# EasyEDA Pro project TeensySensor20250629.eprj

# Schematic Sigyn Sensor Board

## Sheets
1 Teensy: Board Name: Board1; Create Date: 2025-06-20; Page Name: Teensy; Project Name: TeensySensor; Schematic Name: Sigyn Sensor Board; Update Date: 2025-06-19; Company: Wimble Robotics; Drawed: Michael Wimble; Page Size: A4; Part Number: JLCPCB-002; Reviewed: Michael Wimble; Version: V1.0
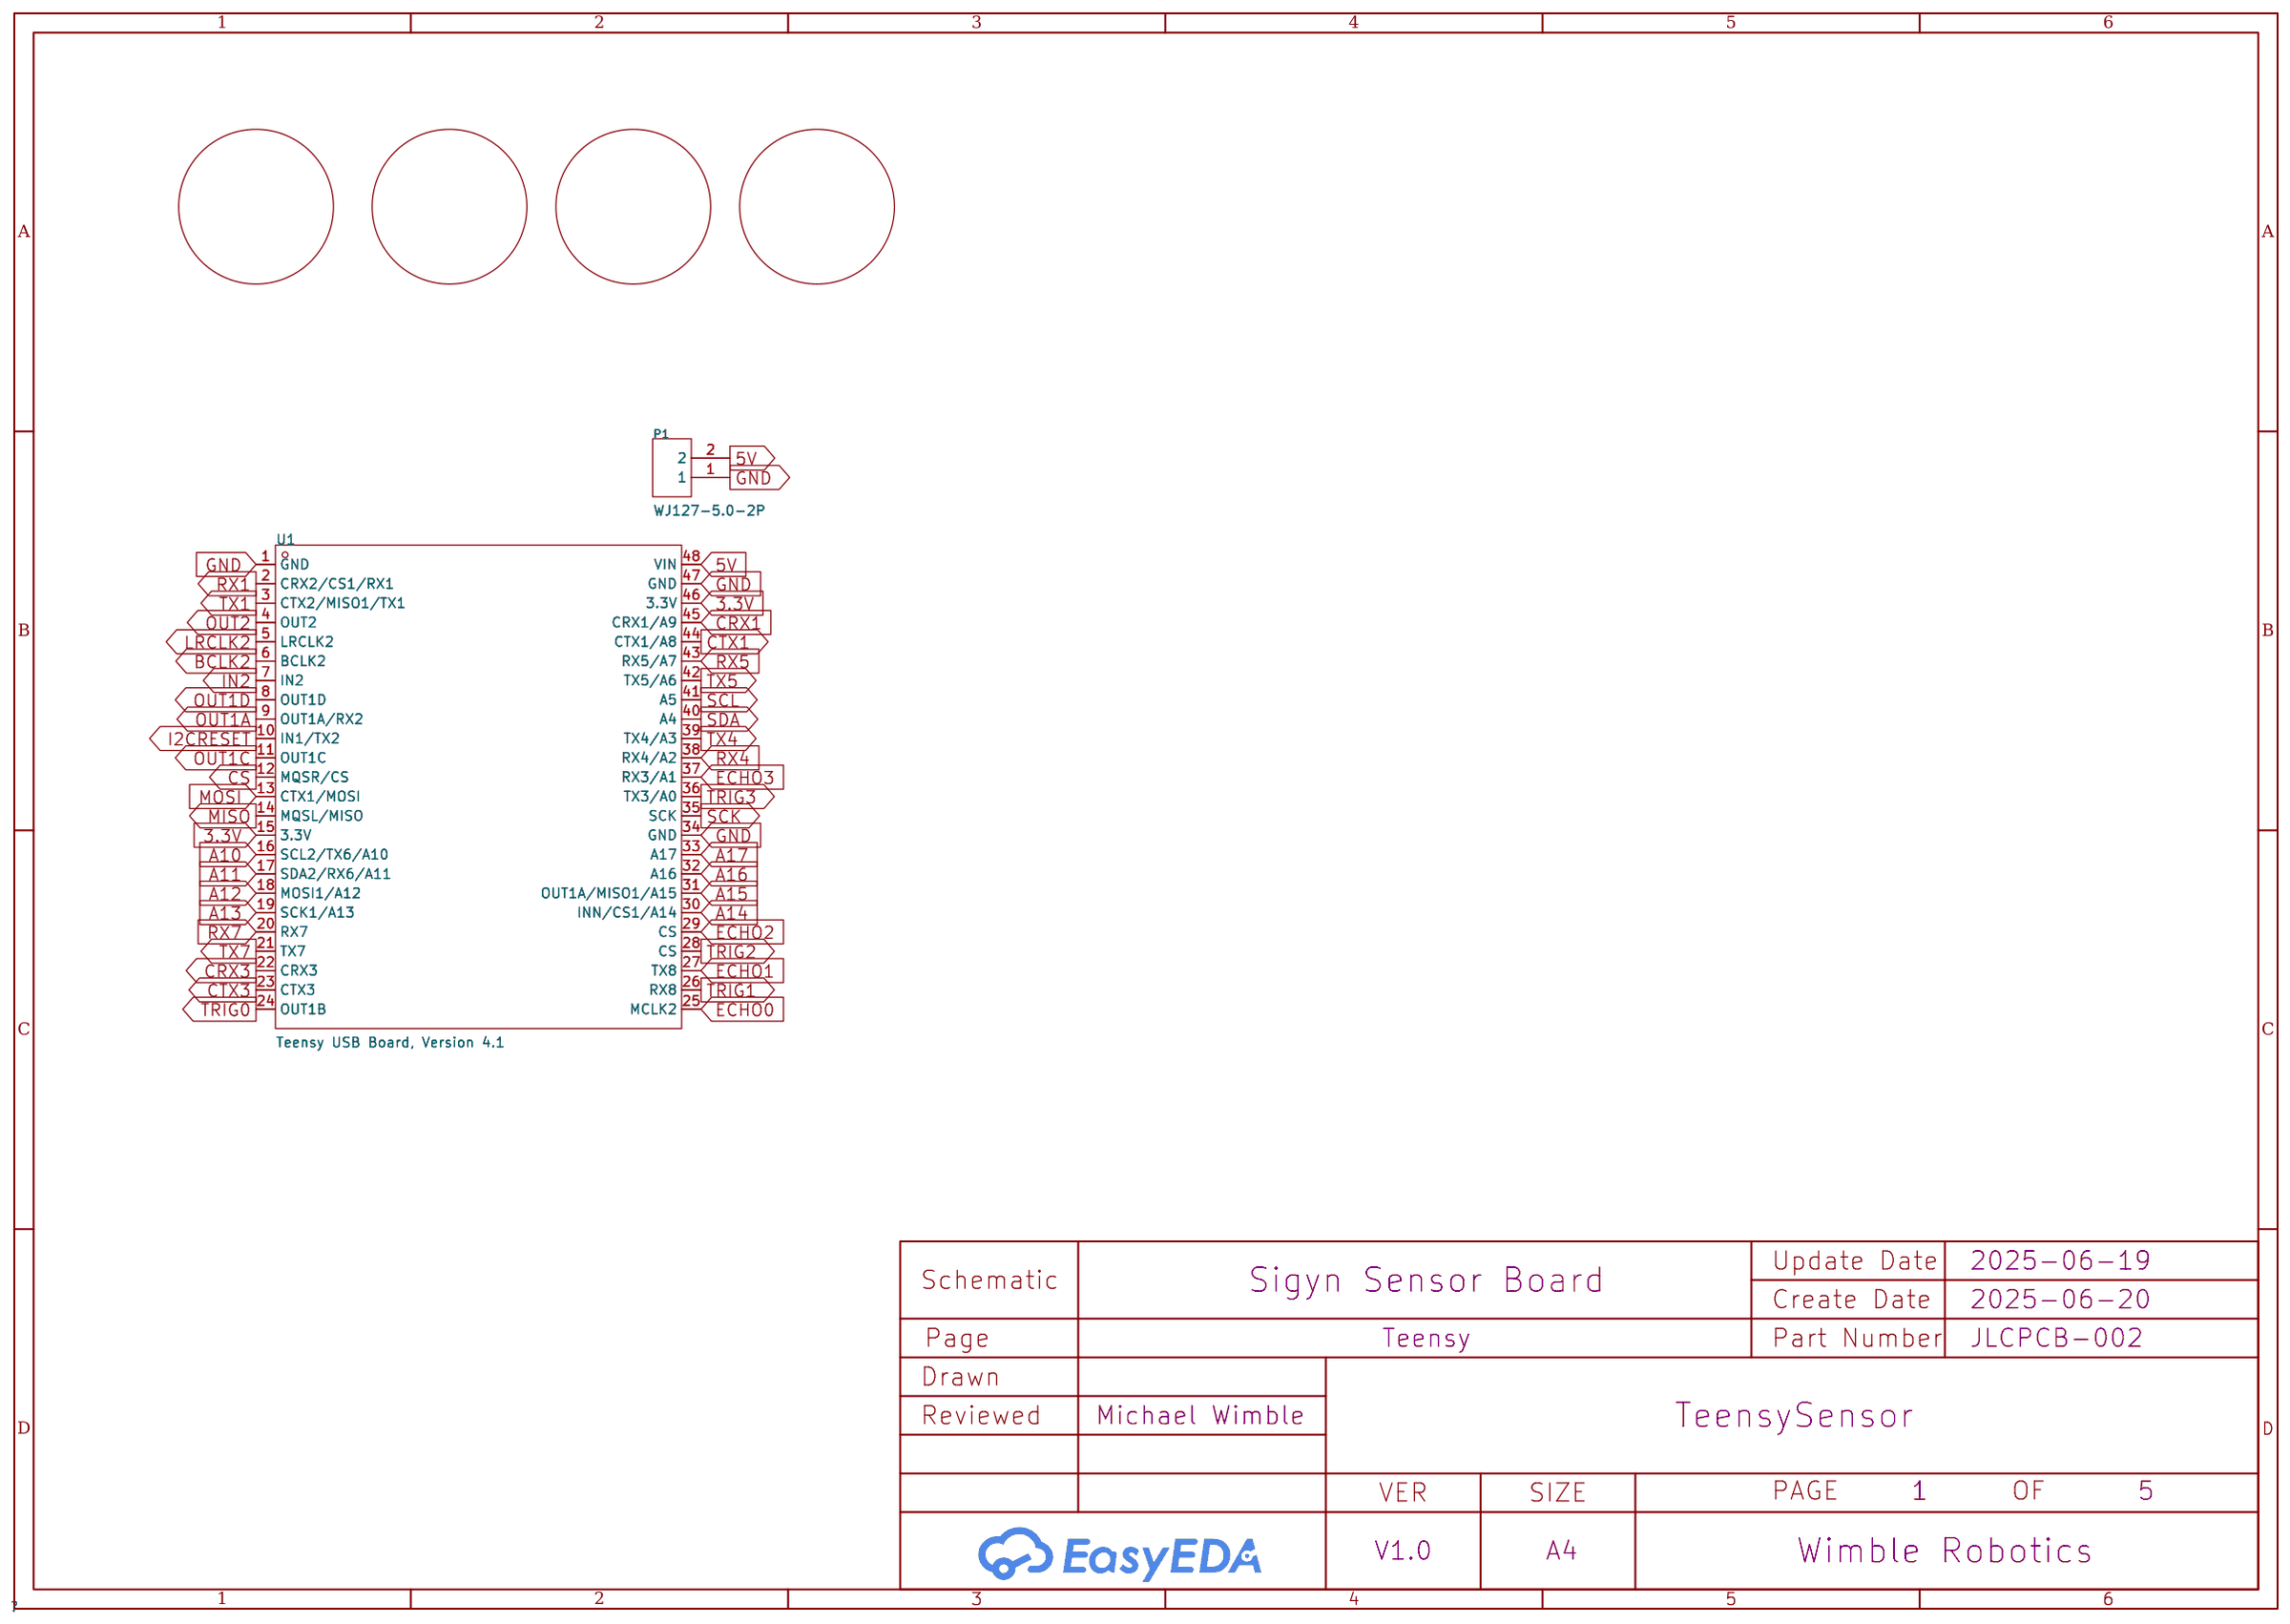
[diagram p0: Teensy]
2 Time of Flight Sensors: Page Name: Time of Flight Sensors
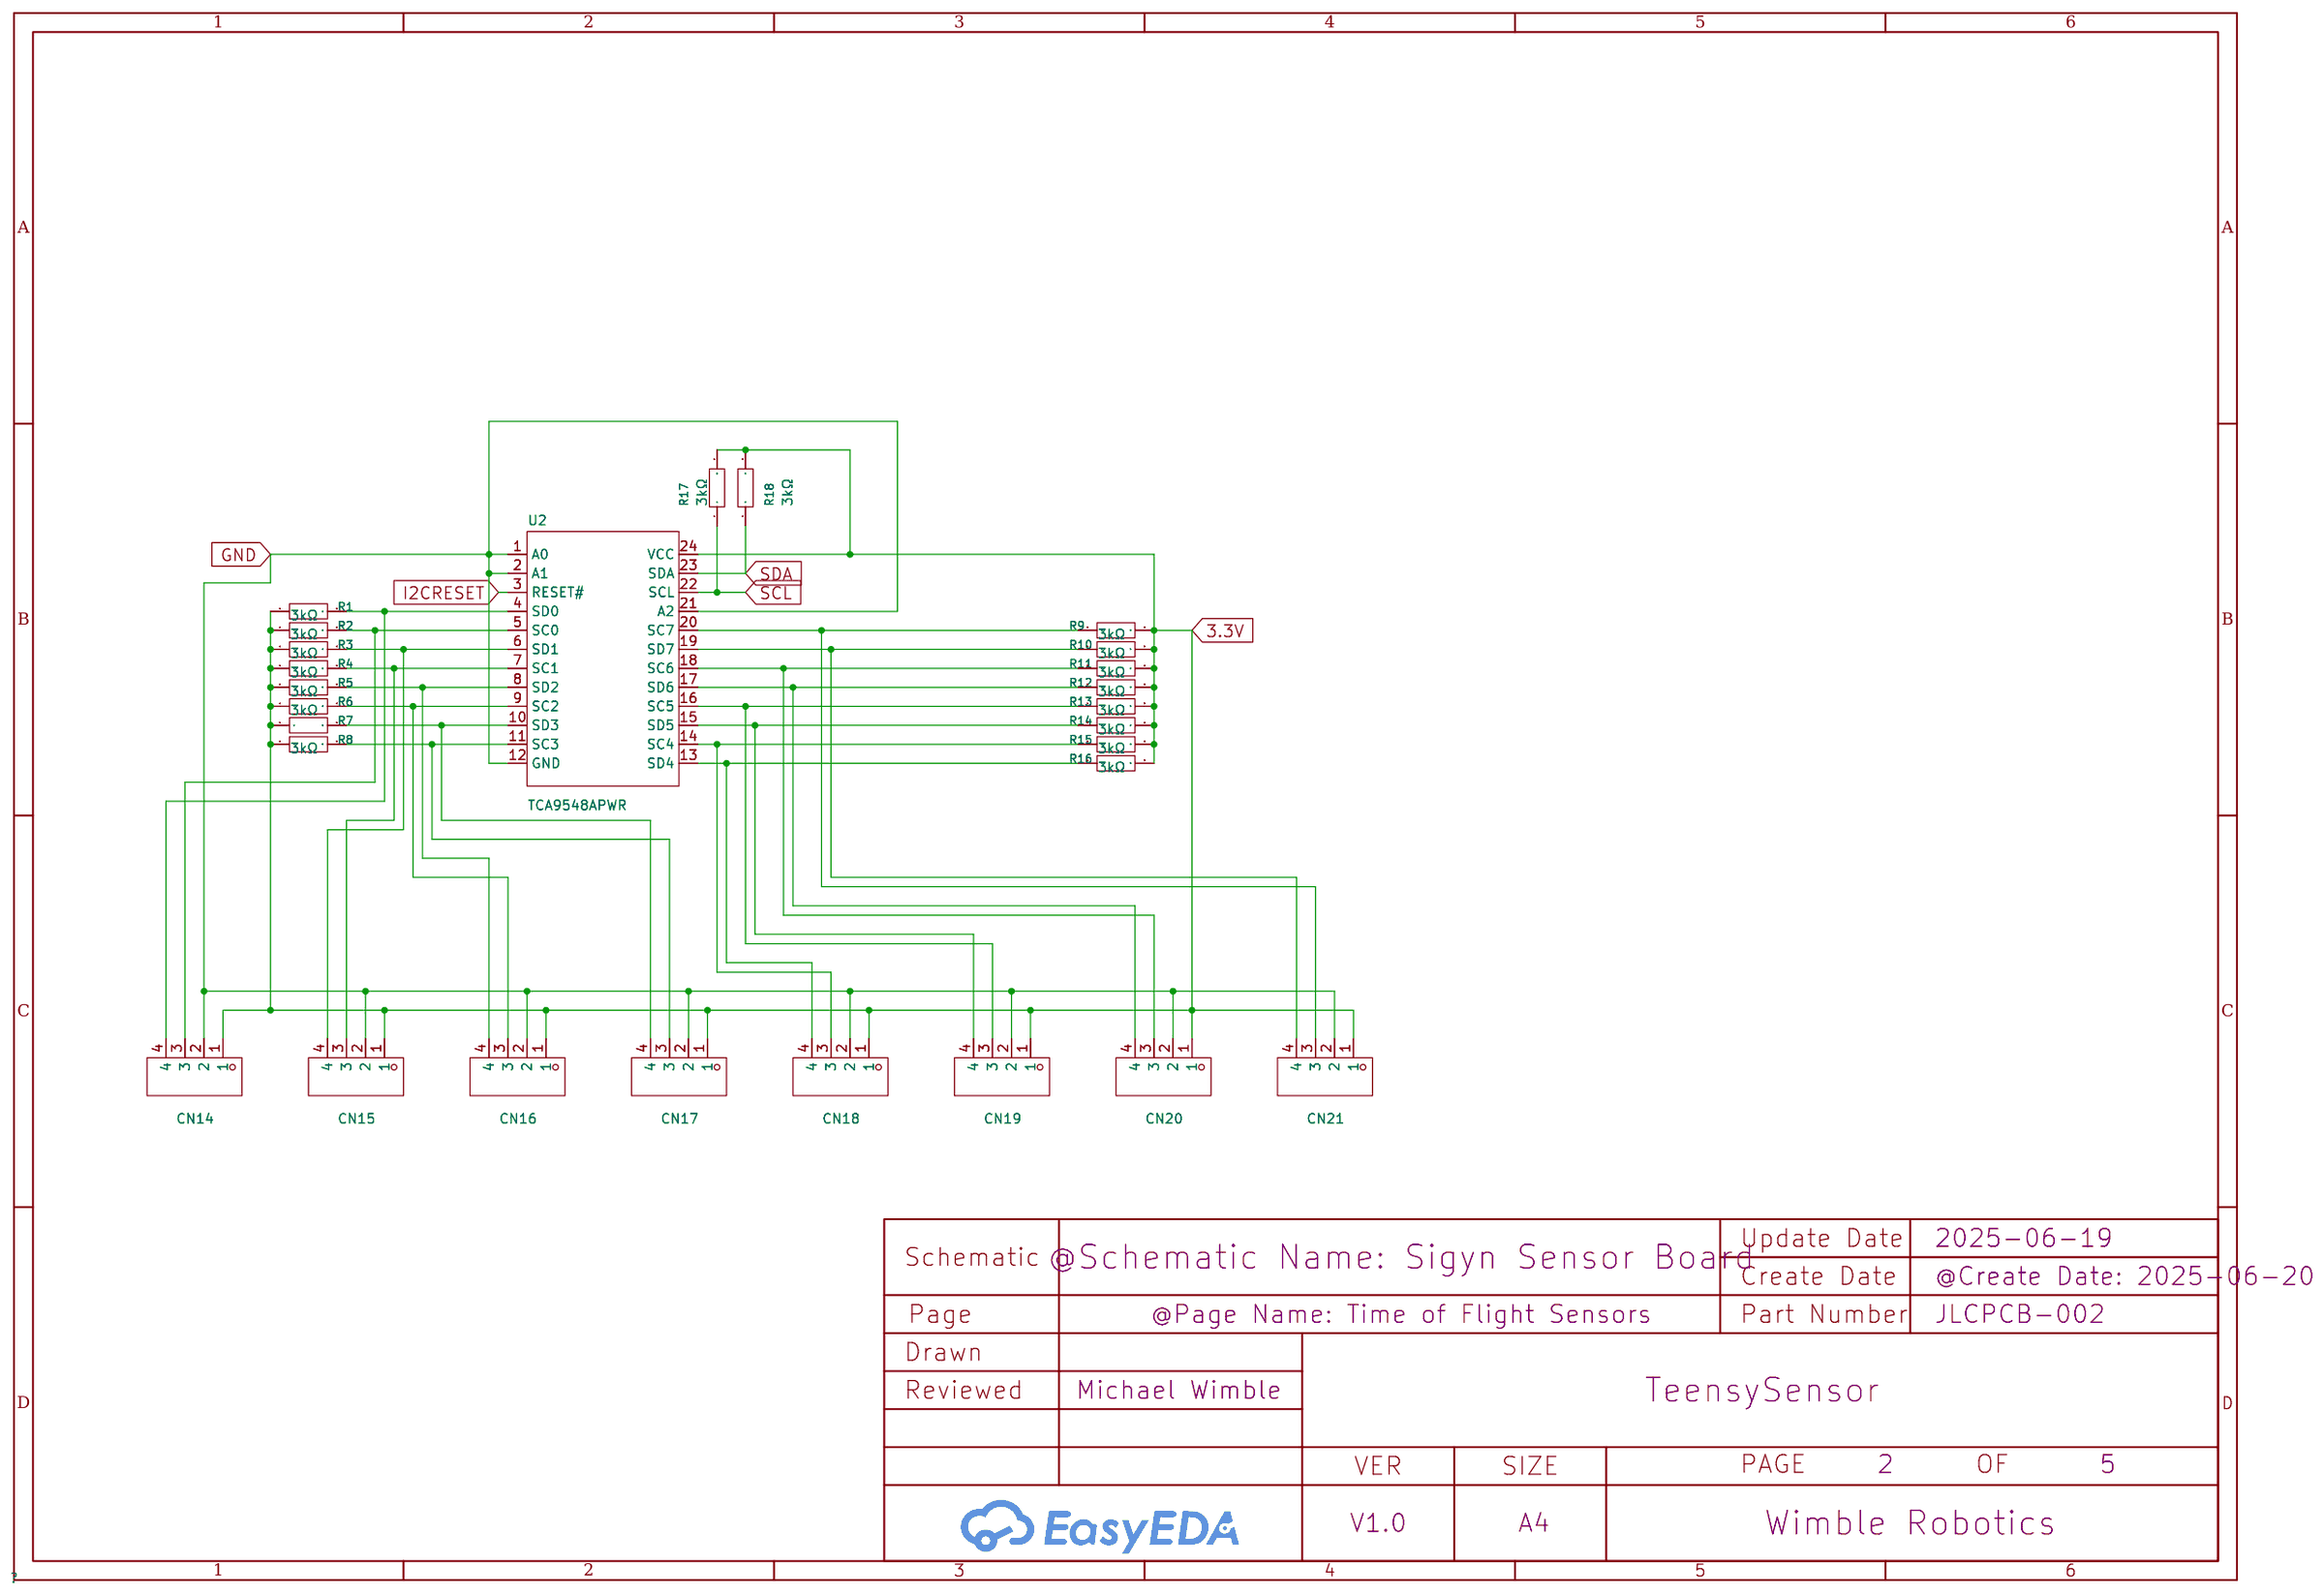
[diagram p1: Time of Flight Sensors]
3 Analog Inputs / Misc: Page Name: Analog Inputs / Misc; Update Date: 2025-06-20
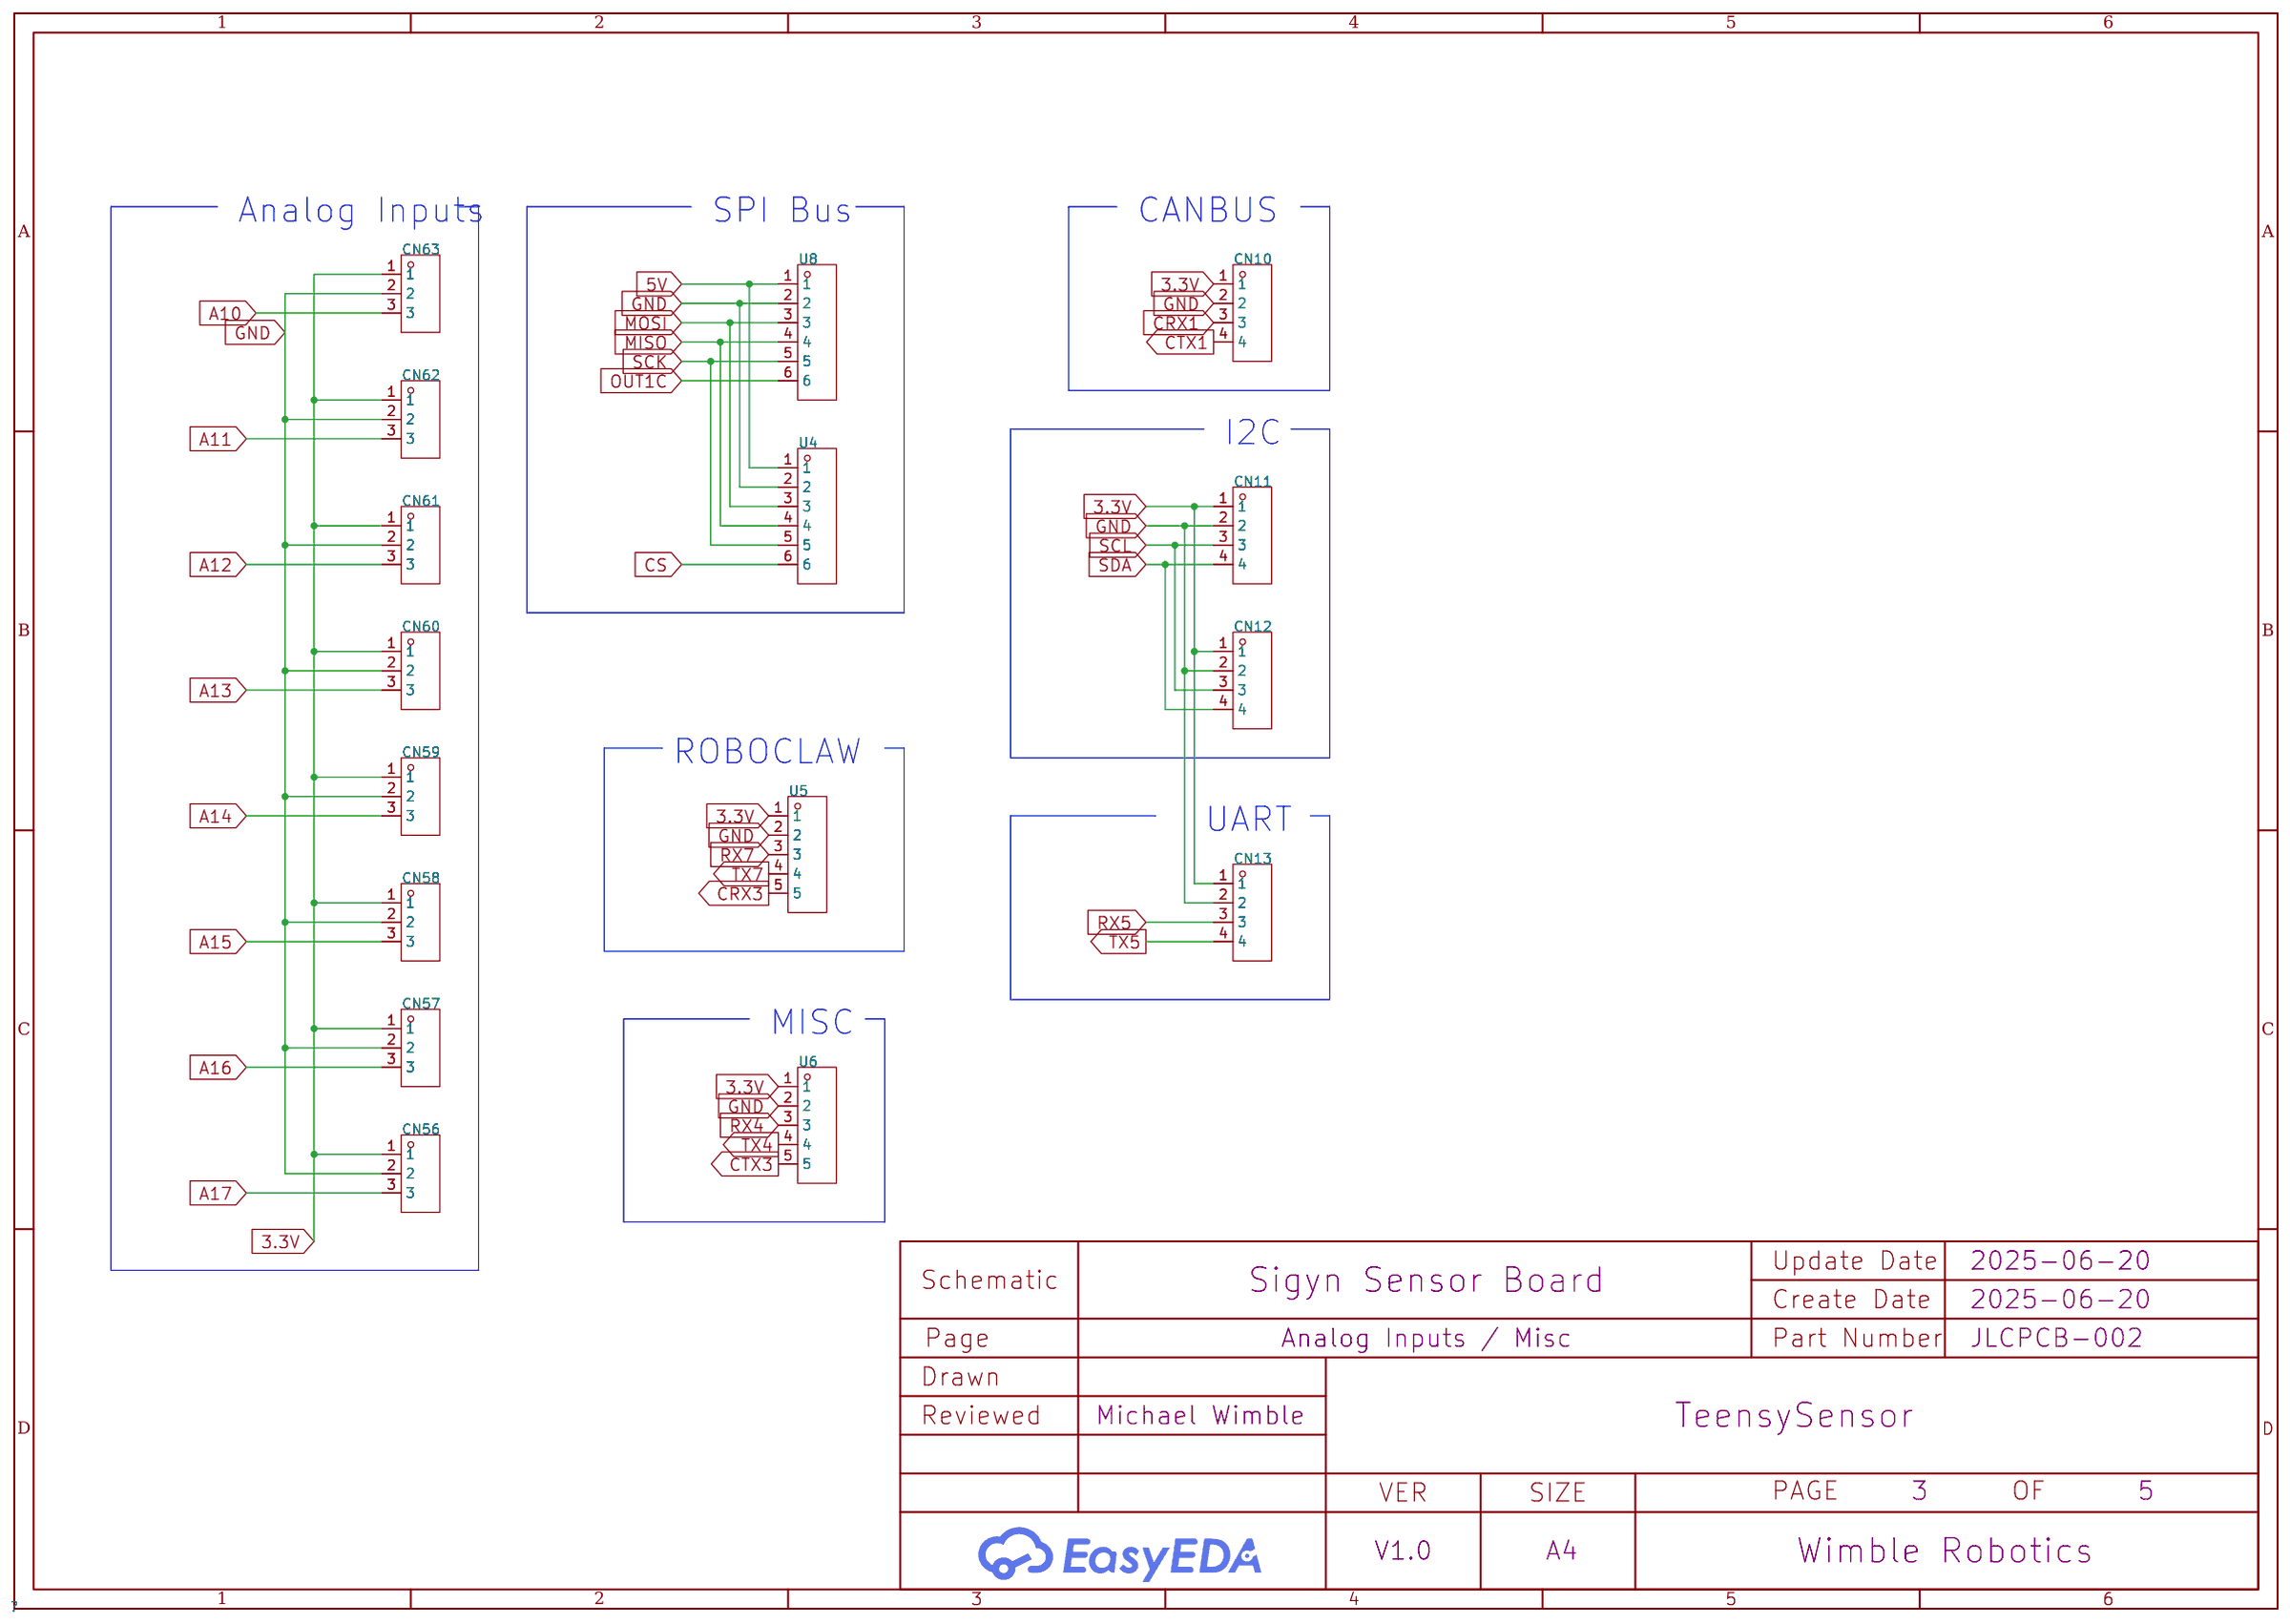
[diagram p2: Analog Inputs / Misc]
4 SONAR: Page Name: SONAR
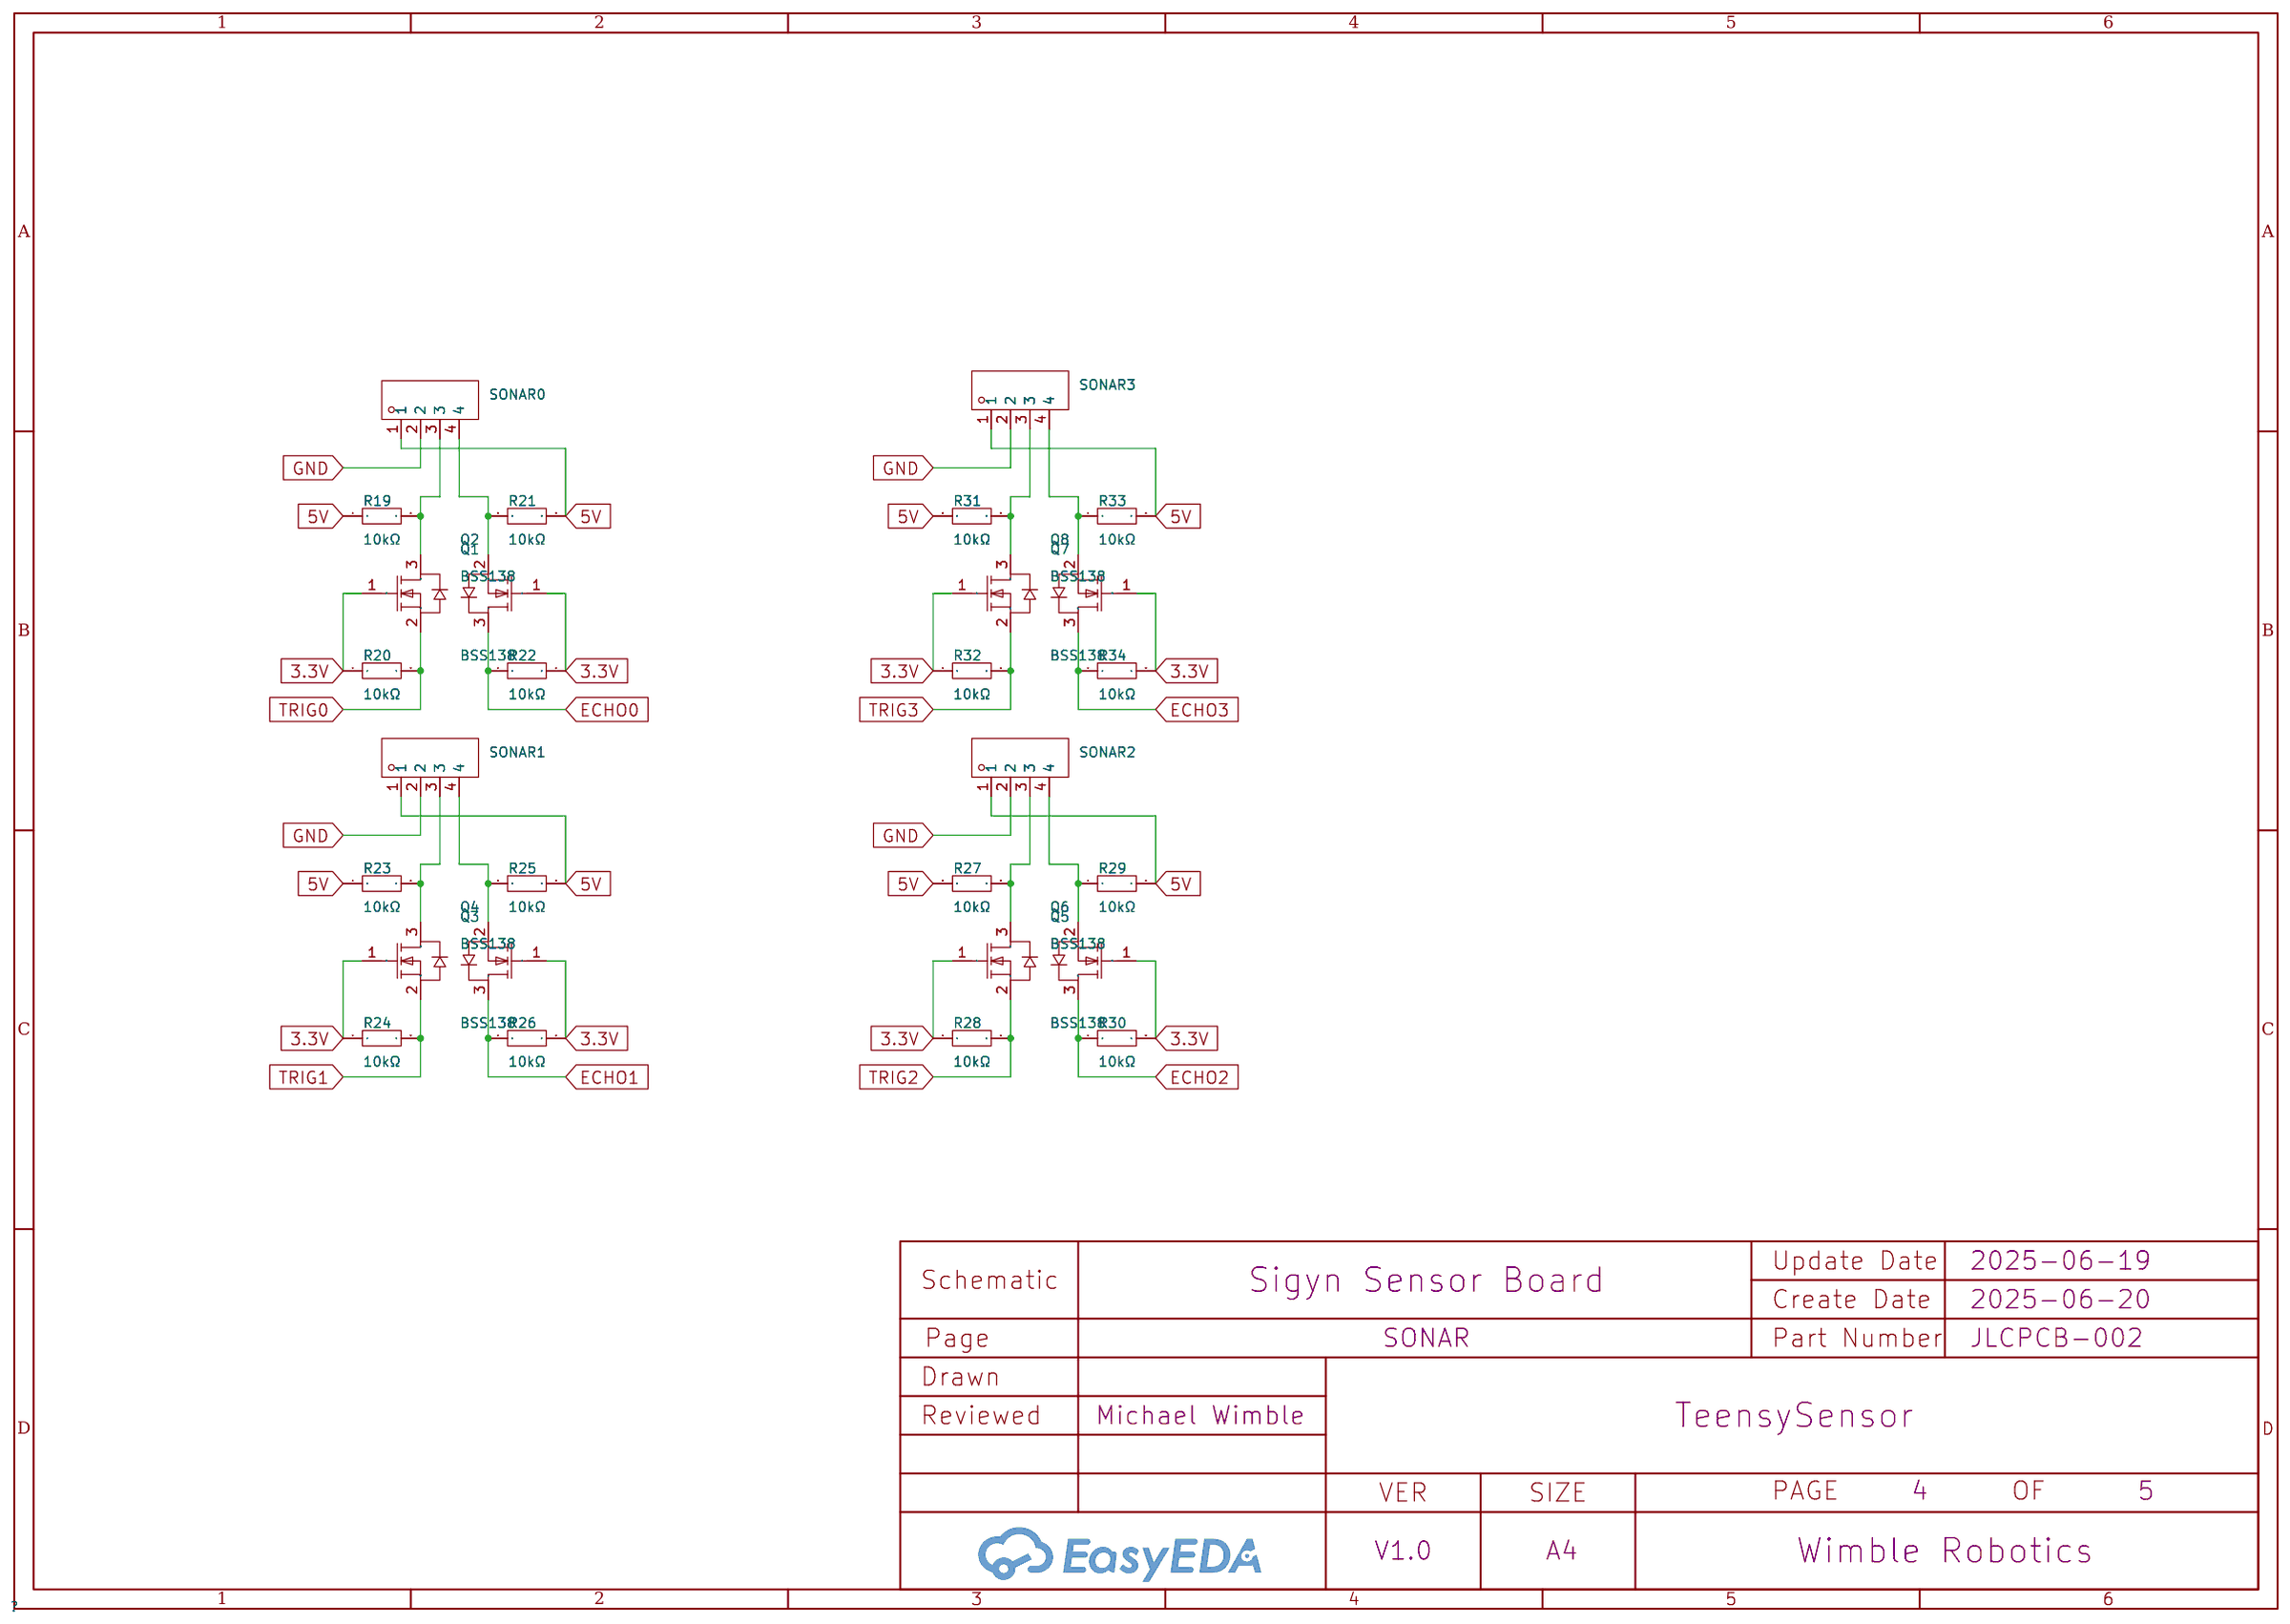
[diagram p3: SONAR]
5 Relays / PWM: Page Name: Relays / PWM; Update Date: 2025-06-20
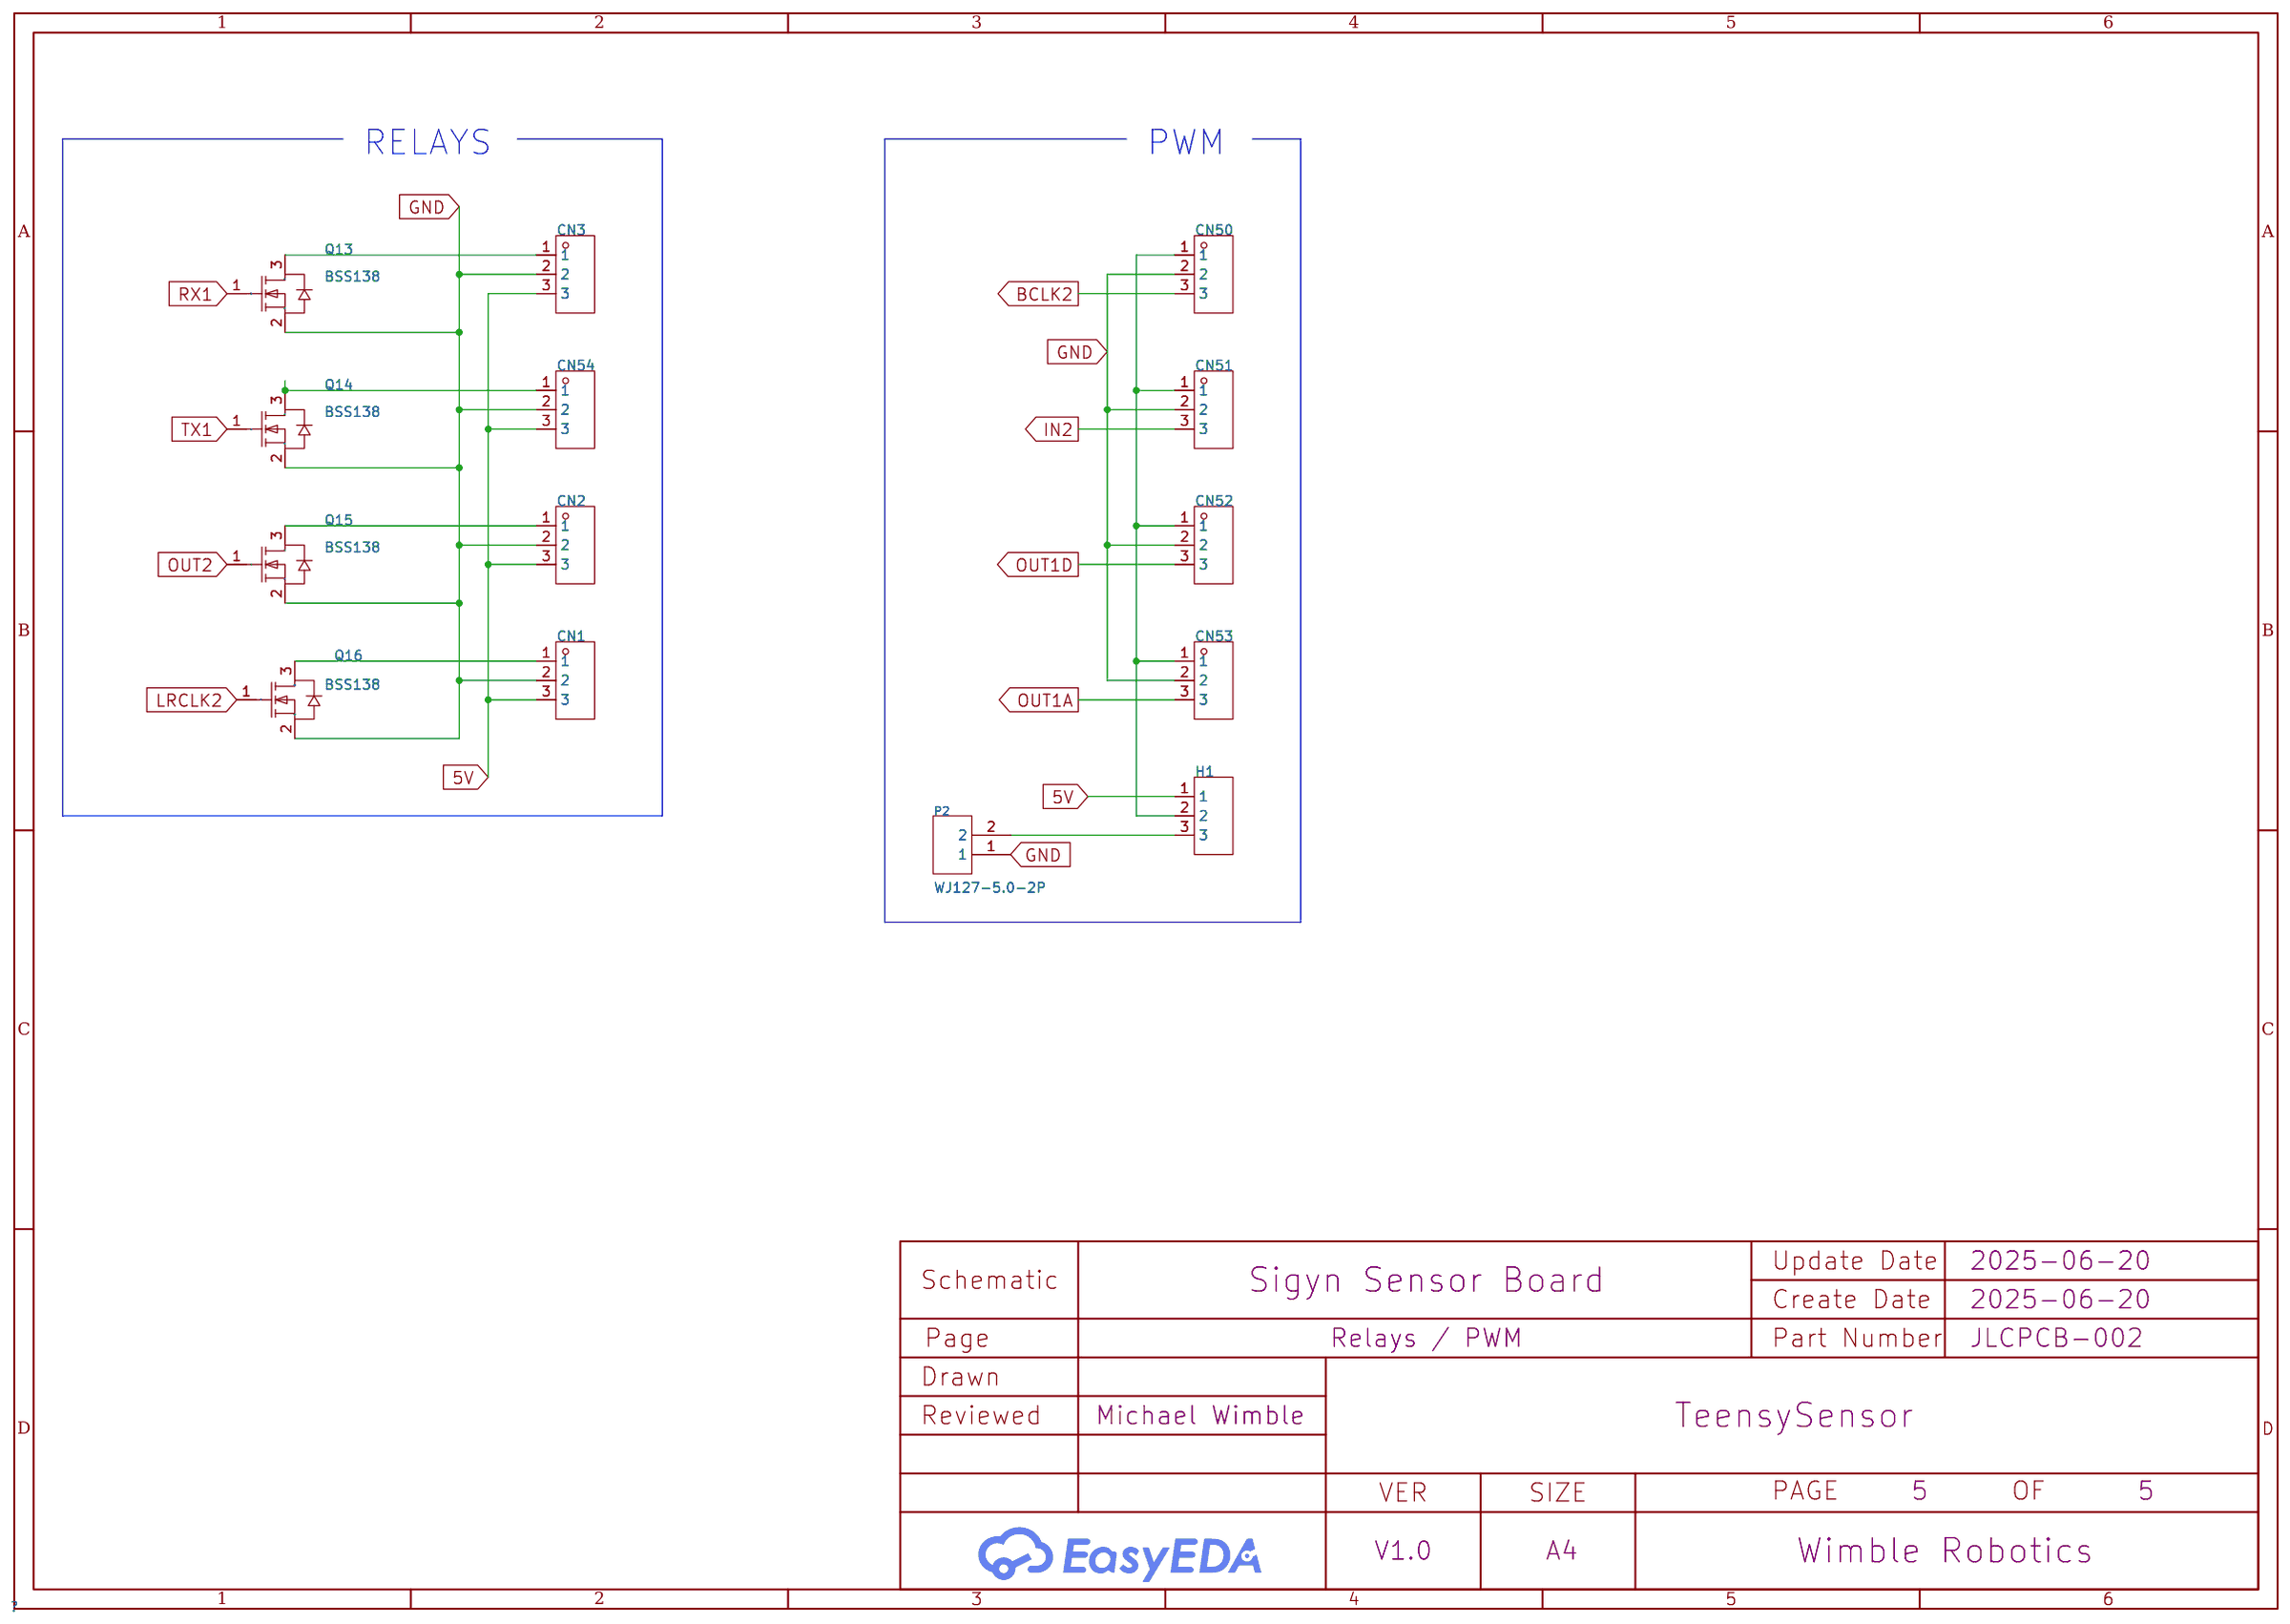
[diagram p4: Relays / PWM]

## Parts
sheet Analog Inputs / Misc
CN10  ZX-XH2.54-4PZZ  [CONN-TH_4P-P2.50_4PIN]
CN11  ZX-XH2.54-4PZZ  [CONN-TH_4P-P2.50_4PIN]
CN12  ZX-XH2.54-4PZZ  [CONN-TH_4P-P2.50_4PIN]
CN13  ZX-XH2.54-4PZZ  [CONN-TH_4P-P2.50_4PIN]
CN56  ZX-XH2.54-3PZZ  [CONN-TH_3P-P2.54_2501S-3P]
CN57  ZX-XH2.54-3PZZ  [CONN-TH_3P-P2.54_2501S-3P]
CN58  ZX-XH2.54-3PZZ  [CONN-TH_3P-P2.54_2501S-3P]
CN59  ZX-XH2.54-3PZZ  [CONN-TH_3P-P2.54_2501S-3P]
CN60  ZX-XH2.54-3PZZ  [CONN-TH_3P-P2.54_2501S-3P]
CN61  ZX-XH2.54-3PZZ  [CONN-TH_3P-P2.54_2501S-3P]
CN62  ZX-XH2.54-3PZZ  [CONN-TH_3P-P2.54_2501S-3P]
CN63  ZX-XH2.54-3PZZ  [CONN-TH_3P-P2.54_2501S-3P]
U4  ZX-XH2.54-6PZZ  [CONN-TH_6P-P2.50_ZX-XH2.54-6PZZ]
U5  ZX-XH2.54-5PZZ  [CONN-TH_5P-P2.50_ZX-XH2.54-5PZZ]
U6  ZX-XH2.54-5PZZ  [CONN-TH_5P-P2.50_ZX-XH2.54-5PZZ]
U8  ZX-XH2.54-6PZZ  [CONN-TH_6P-P2.50_ZX-XH2.54-6PZZ]
sheet Relays / PWM
CN1  ZX-XH2.54-3PZZ  [CONN-TH_3P-P2.54_2501S-3P]
CN2  ZX-XH2.54-3PZZ  [CONN-TH_3P-P2.54_2501S-3P]
CN3  ZX-XH2.54-3PZZ  [CONN-TH_3P-P2.54_2501S-3P]
CN50  ZX-XH2.54-3PZZ  [CONN-TH_3P-P2.54_2501S-3P]
CN51  ZX-XH2.54-3PZZ  [CONN-TH_3P-P2.54_2501S-3P]
CN52  ZX-XH2.54-3PZZ  [CONN-TH_3P-P2.54_2501S-3P]
CN53  ZX-XH2.54-3PZZ  [CONN-TH_3P-P2.54_2501S-3P]
CN54  ZX-XH2.54-3PZZ  [CONN-TH_3P-P2.54_2501S-3P]
H1  PZ254V-11-03P  [HDR-TH_3P-P2.54-V-M]
P2  WJ127-5.0-2P  [CONN-TH_2P-P5.00_CPC3703CTR]
Q13  BSS138  [SOT-23-3_L2.9-W1.6-P1.90-LS2.8-BR]
Q14  BSS138  [SOT-23-3_L2.9-W1.6-P1.90-LS2.8-BR]
Q15  BSS138  [SOT-23-3_L2.9-W1.6-P1.90-LS2.8-BR]
Q16  BSS138  [SOT-23-3_L2.9-W1.6-P1.90-LS2.8-BR]
sheet SONAR
Q1  BSS138  [SOT-23-3_L2.9-W1.6-P1.90-LS2.8-BR]
Q2  BSS138  [SOT-23-3_L2.9-W1.6-P1.90-LS2.8-BR]
Q3  BSS138  [SOT-23-3_L2.9-W1.6-P1.90-LS2.8-BR]
Q4  BSS138  [SOT-23-3_L2.9-W1.6-P1.90-LS2.8-BR]
Q5  BSS138  [SOT-23-3_L2.9-W1.6-P1.90-LS2.8-BR]
Q6  BSS138  [SOT-23-3_L2.9-W1.6-P1.90-LS2.8-BR]
Q7  BSS138  [SOT-23-3_L2.9-W1.6-P1.90-LS2.8-BR]
Q8  BSS138  [SOT-23-3_L2.9-W1.6-P1.90-LS2.8-BR]
R19  10kΩ  [R0603]
R20  10kΩ  [R0603]
R21  10kΩ  [R0603]
R22  10kΩ  [R0603]
R23  10kΩ  [R0603]
R24  10kΩ  [R0603]
R25  10kΩ  [R0603]
R26  10kΩ  [R0603]
R27  10kΩ  [R0603]
R28  10kΩ  [R0603]
R29  10kΩ  [R0603]
R30  10kΩ  [R0603]
R31  10kΩ  [R0603]
R32  10kΩ  [R0603]
R33  10kΩ  [R0603]
R34  10kΩ  [R0603]
SONAR0  ZX-XH2.54-4PZZ  [CONN-TH_4P-P2.50_4PIN]
SONAR1  ZX-XH2.54-4PZZ  [CONN-TH_4P-P2.50_4PIN]
SONAR2  ZX-XH2.54-4PZZ  [CONN-TH_4P-P2.50_4PIN]
SONAR3  ZX-XH2.54-4PZZ  [CONN-TH_4P-P2.50_4PIN]
sheet Teensy
P1  WJ127-5.0-2P  [CONN-TH_2P-P5.00_CPC3703CTR]
U1  Teensy USB Board, Version 4.1  [COMM-TH_L61.0-W17.8-P2.54]
U12  -  [3.5mm_Hole]
U13  -  [3.5mm_Hole]
U14  -  [3.5mm_Hole]
U15  -  [3.5mm_Hole]
sheet Time of Flight Sensors
CN14  ZX-XH2.54-4PZZ  [CONN-TH_4P-P2.50_4PIN]
CN15  ZX-XH2.54-4PZZ  [CONN-TH_4P-P2.50_4PIN]
CN16  ZX-XH2.54-4PZZ  [CONN-TH_4P-P2.50_4PIN]
CN17  ZX-XH2.54-4PZZ  [CONN-TH_4P-P2.50_4PIN]
CN18  ZX-XH2.54-4PZZ  [CONN-TH_4P-P2.50_4PIN]
CN19  ZX-XH2.54-4PZZ  [CONN-TH_4P-P2.50_4PIN]
CN20  ZX-XH2.54-4PZZ  [CONN-TH_4P-P2.50_4PIN]
CN21  ZX-XH2.54-4PZZ  [CONN-TH_4P-P2.50_4PIN]
R1  3kΩ  [R0603]
R2  3kΩ  [R0603]
R3  3kΩ  [R0603]
R4  3kΩ  [R0603]
R5  3kΩ  [R0603]
R6  3kΩ  [R0603]
R7  3kΩ  [R0603]
R8  3kΩ  [R0603]
R9  3kΩ  [R0603]
R10  3kΩ  [R0603]
R11  3kΩ  [R0603]
R12  3kΩ  [R0603]
R13  3kΩ  [R0603]
R14  3kΩ  [R0603]
R15  3kΩ  [R0603]
R16  3kΩ  [R0603]
R17  3kΩ  [R0603]
R18  3kΩ  [R0603]
U2  TCA9548APWR  [TSSOP-24_L7.8-W4.4-P0.65-LS6.4-BL]

## Library data of the parts
CN10-CN21 SONAR0-SONAR3 = ZX-XH2.54-4PZZ: Pins Structure:1x4P Pitch:2.5mm Mounting Type:Direct Insert Reference Series:XH Number of Pins:4P Number of Rows:1 Number of PINs Per Row:4 Row Spacing:- Rated Current:3A Contact Material:Brass Contact Plating:Tin Operating Temperature:-25℃~+85℃ Operating; LCSC Part Name: 1x4P 间距:2.5mm 直插 系列:XH; Supplier Part: C7429634; Manufacturer: Megastar(兆星); Supplier Footprint: 插件,P=2.5mm; JLCPCB Part Class: Extended Part; Datasheet: https://atta.szlcsc.com/upload/public/pdf/source/20230619/B529A2163E0159A644AB3383D208FB03.pdf; Supplier: LCSC; Pins Structure: 1x4P; Pitch: 2.5mm; Mounting Type: Direct Insert; Reference Series: XH; Number of Pins: 4P; Number of Rows: 1; Number of PINs Per Row: 4; Rated Current: 3A; Contact Material: Brass; Contact Plating: Tin; Operating Temperature: -25℃~+85℃; Rated Voltage (Max): 250V; Plastic Material: PA66; Flame Retardant Rating: UL94V-0; Color: White; Z-Height of the Board: 7mm; X-Length of Bottom Edge on Board (Spacing Line): 12.5mm; Y-Width of Bottom Edge on Board: 5.9mm
CN1-CN3 CN50-CN54 CN56-CN63 = ZX-XH2.54-3PZZ: Pins Structure:1x3P Pitch:2.5mm Mounting Type:Direct Insert Reference Series:XH Number of Pins:3P Number of Rows:1 Number of PINs Per Row:3 Row Spacing:- Rated Current:3A Contact Material:Brass Contact Plating:Tin Operating Temperature:-25℃~+85℃ Operating; LCSC Part Name: 1x3P 间距:2.5mm 直插 系列:XH; Supplier Part: C7429633; Manufacturer: Megastar(兆星); Supplier Footprint: 插件,P=2.5mm; JLCPCB Part Class: Extended Part; Datasheet: https://atta.szlcsc.com/upload/public/pdf/source/20230619/AE17037A2CFDBE8D9CBA775D61AD0A84.pdf; Supplier: LCSC; Pins Structure: 1x3P; Pitch: 2.5mm; Mounting Type: Direct Insert; Reference Series: XH; Number of Pins: 3P; Number of Rows: 1; Number of PINs Per Row: 3; Rated Current: 3A; Contact Material: Brass; Contact Plating: Tin; Operating Temperature: -25℃~+85℃; Rated Voltage (Max): 250V; Plastic Material: PA66; Flame Retardant Rating: UL94V-0; Color: White; Z-Height of the Board: 7mm; X-Length of Bottom Edge on Board (Spacing Line): 10mm; Y-Width of Bottom Edge on Board: 5.9mm
U4 U8 = ZX-XH2.54-6PZZ: Pins Structure:1x6P Pitch:2.5mm Mounting Type:Direct Insert Reference Series:XH Number of Pins:6P Number of Rows:1 Number of PINs Per Row:6 Row Spacing:- Rated Current:3A Contact Material:Brass Contact Plating:Tin Operating Temperature:-25℃~+85℃ Operating; LCSC Part Name: 1x6P 间距:2.5mm 直插 系列:XH; Supplier Part: C7429636; Manufacturer: Megastar(兆星); Supplier Footprint: 插件,P=2.5mm; JLCPCB Part Class: Extended Part; Datasheet: https://atta.szlcsc.com/upload/public/pdf/source/20230619/1243AD0A516E39CD3D274D8985780568.pdf; Supplier: LCSC; Pins Structure: 1x6P; Pitch: 2.5mm; Mounting Type: Direct Insert; Reference Series: XH; Number of Pins: 6P; Number of Rows: 1; Number of PINs Per Row: 6; Rated Current: 3A; Contact Material: Brass; Contact Plating: Tin; Operating Temperature: -25℃~+85℃; Rated Voltage (Max): 250V; Plastic Material: PA66; Flame Retardant Rating: UL94V-0; Color: White; Z-Height of the Board: 7mm; X-Length of Bottom Edge on Board (Spacing Line): 17.5mm; Y-Width of Bottom Edge on Board: 5.9mm
U5 U6 = ZX-XH2.54-5PZZ: Pins Structure:1x5P Pitch:2.5mm Mounting Type:Direct Insert Reference Series:XH Number of Pins:5P Number of Rows:1 Number of PINs Per Row:5 Row Spacing:- Rated Current:3A Contact Material:Brass Contact Plating:Tin Operating Temperature:-25℃~+85℃ Operating; LCSC Part Name: 1x5P 间距:2.5mm 直插 系列:XH; Supplier Part: C7429635; Manufacturer: Megastar(兆星); Supplier Footprint: 插件,P=2.5mm; JLCPCB Part Class: Extended Part; Datasheet: https://atta.szlcsc.com/upload/public/pdf/source/20230619/60EEF4ADD558E90BFFACF5D939816781.pdf; Supplier: LCSC; Pins Structure: 1x5P; Pitch: 2.5mm; Mounting Type: Direct Insert; Reference Series: XH; Number of Pins: 5P; Number of Rows: 1; Number of PINs Per Row: 5; Rated Current: 3A; Contact Material: Brass; Contact Plating: Tin; Operating Temperature: -25℃~+85℃; Rated Voltage (Max): 250V; Plastic Material: PA66; Flame Retardant Rating: UL94V-0; Color: White; Z-Height of the Board: 7mm; X-Length of Bottom Edge on Board (Spacing Line): 15mm; Y-Width of Bottom Edge on Board: 5.9mm
H1 = PZ254V-11-03P: Pin Structure:1x3P Pitch:2.54mm Row Spacing:- Circluar Pins/Square Pins:Policy Mounting Type:Straight Number of Rows:Single Row Number of Pins:3P Current Rating:3A Voltage Rating (Max):250V Length of Mating Pin:6mm Insulation Height:2.5mm Length of End Co; LCSC Part Name: 1x3P 间距:2.54mm 方针 直插; Supplier Part: C2937625; Manufacturer: XFCN(兴飞); Supplier Footprint: 插件,P=2.54mm; JLCPCB Part Class: Extended Part; Datasheet: https://atta.szlcsc.com/upload/public/pdf/source/20200309/C492402_8335C3D49C4E4C618838D59BB1D024C1.pdf; Supplier: LCSC; Pin Structure: 1x3P; Pitch: 2.54mm; Circluar Pins/Square Pins: Policy; Mounting Type: Straight; Number of Rows: Single Row; Number of Pins: 3P; Current Rating: 3A; Voltage Rating (Max): 250V; Length of Mating Pin: 6mm; Insulation Height: 2.5mm; Length of End Connection Pin: 3mm; Operating Temperature: -40℃~+105℃; Color: Black
P1 P2 = WJ127-5.0-2P_C3703: Structure:1x2P Pitch:5mm Color:Green Mounting Style:Straight Current Rating (Max):15A Voltage Rating (Max):250V Number of Pins:2P Number of Rows:1 Wire Gauge - AWG:14~26 Wire Gauge - AWG:14~26 Wire Gauge - mm2:1.5 Wire Gauge - mm2:1.5 Number of PINs Per R; LCSC Part Name: 5mm 1x2P 排数:1 每排P数:2 直插; Supplier Part: C3703; Manufacturer: KANGNEX(康奈克斯电气); Supplier Footprint: 插件,P=5mm; JLCPCB Part Class: Extended Part; Datasheet: https://atta.szlcsc.com/upload/public/pdf/source/20191225/C3703_1F4D1F1BB9E32B564BC518663FFF2A0C.pdf; Supplier: LCSC; Structure: 1x2P; Pitch: 5mm; Color: Green; Mounting Style: Straight; Current Rating (Max): 15A; Voltage Rating (Max): 250V; Number of Pins: 2P; Number of Rows: 1; Wire Gauge - AWG: 14~26; Wire Gauge - mm2: 1.5; Number of PINs Per Row: 2; Operating Temperature Range: -40℃~+105℃
Q1-Q8 Q13-Q16 = BSS138_C18212695: Drain to Source Voltage:50V Current - Continuous Drain(Id):360mA RDS(on):2Ω@2.5V,0.1A Pd - Power Dissipation:350mW Gate Threshold Voltage (Vgs(th)@Id):800mV Gate Charge(Qg):4nC@25V Input Capacitance(Ciss@Vds):32pF Reverse Transfer Capacitance (Crss@Vds):3; LCSC Part Name: 耐压:50V 电流:360mA; Supplier Part: C18212695; Manufacturer: TECH PUBLIC(台舟); Supplier Footprint: SOT-23; JLCPCB Part Class: Extended Part; Datasheet: https://atta.szlcsc.com/upload/public/pdf/source/20231024/96ACE9C5A32B7F4113654DA9CE24FCA4.pdf; Supplier: LCSC; Drain to Source Voltage: 50V; Current - Continuous Drain(Id): 360mA; RDS(on): 2Ω@2.5V,0.1A; Pd - Power Dissipation: 350mW; Gate Threshold Voltage (Vgs(th)@Id): 800mV; Gate Charge(Qg): 4nC@25V; Input Capacitance(Ciss@Vds): 32pF; Reverse Transfer Capacitance (Crss@Vds): 3pF@25V; Operating Temperature: -55℃~+150℃
R19-R34 = RC0603FR-0710KL: Type:Thick Film Resistors Resistance: Tolerance:±1% Tolerance:±1% Power(Watts): Overload Voltage (Max): Temperature Coefficient:±100ppm/℃ Temperature Coefficient:±100ppm/℃ Operating Temperature Range:-55℃~+155℃ Operating Temperature Range:-55℃~+155℃; LCSC Part Name: 厚膜电阻 10kΩ ±1% 100mW; Supplier Part: C98220; Manufacturer: YAGEO(国巨); Supplier Footprint: 0603; JLCPCB Part Class: Extended Part; Datasheet: https://atta.szlcsc.com/upload/public/pdf/source/20180927/C295883_E8D83085EA81BD7DE0B2B681138C15EE.pdf; Supplier: LCSC; Type: Thick Film Resistors; Tolerance: ±1%; Temperature Coefficient: ±100ppm/℃; Operating Temperature Range: -55℃~+155℃
U1 = Teensy USB Board, Version 4.1: Supplier Part: C9900060513; Supplier Footprint: 插件; JLCPCB Part Class: Extended Part; Supplier: LCSC
U12-U15 = 3.5MMHole: Mounting hole
R1-R18 = 0603WAF3001T5E: Type:Thick Film Resistors Resistance:3kΩ Tolerance:±1% Tolerance:±1% Power(Watts):0.1W Voltage-Supply(Max):75V Temperature Coefficient:±100ppm/℃ Temperature Coefficient:±100ppm/℃ Operating Temperature:-55℃~+155℃ Operating Temperature:-55℃~+155℃; LCSC Part Name: 3kΩ ±1% 100mW 厚膜电阻; Supplier Part: C4211; Manufacturer: UNI-ROYAL(厚声); Supplier Footprint: 0603; JLCPCB Part Class: Basic Part; Datasheet: https://atta.szlcsc.com/upload/public/pdf/source/20200306/C422600_1E6D84923E4A46A82E41ADD87F860B5C.pdf; Supplier: LCSC; Type: Thick Film Resistors; Tolerance: ±1%; Power(Watts): 0.1W; Voltage-Supply(Max): 75V; Temperature Coefficient: ±100ppm/℃; Operating Temperature: -55℃~+155℃
U2 = TCA9548APWR: Supplier Part: C130026; Manufacturer: TI(德州仪器); Supplier Footprint: TSSOP-24; JLCPCB Part Class: Extended Part; Datasheet: https://www.ti.com/cn/lit/gpn/tca9548a; Supplier: LCSC

## Nets
3.3V: CN10.1 CN11.1 CN12.1 CN13.1 CN14.1 CN15.1 CN16.1 CN17.1 CN18.1 CN19.1 CN20.1 CN21.1 CN56.1 CN57.1 CN58.1 CN59.1 CN60.1 CN61.1 CN62.1 CN63.1 Q1.1(G) Q2.1(G) Q3.1(G) Q4.1(G) Q5.1(G) Q6.1(G) Q7.1(G) Q8.1(G) R1.1 R2.1 R3.1 R4.1 R5.1 R6.1 R7.1 R8.1 R9.2 R10.2 R11.2 R12.2 R13.2 R14.2 R15.2 R16.2 R17.2 R18.2 R20.1 R22.2 R24.1 R26.2 R28.1 R30.2 R32.1 R34.2 U1.15(3.3V) U1.46(3.3V) U2.24(VCC) U5.1 U6.1
5V: CN1.3 CN2.3 CN3.3 CN54.3 H1.1 P1.2 R19.1 R21.2 R23.1 R25.2 R27.1 R29.2 R31.1 R33.2 SONAR0.1 SONAR1.1 SONAR2.1 SONAR3.1 U1.48(VIN) U4.1 U8.1
GND: CN1.2 CN2.2 CN3.2 CN10.2 CN11.2 CN12.2 CN13.2 CN14.2 CN15.2 CN16.2 CN17.2 CN18.2 CN19.2 CN20.2 CN21.2 CN50.2 CN51.2 CN52.2 CN53.2 CN54.2 CN56.2 CN57.2 CN58.2 CN59.2 CN60.2 CN61.2 CN62.2 CN63.2 P1.1 P2.1 Q13.2(S) Q14.2(S) Q15.2(S) Q16.2(S) SONAR0.2 SONAR1.2 SONAR2.2 SONAR3.2 U1.1(GND) U1.34(GND) U1.47(GND) U2.1(A0) U2.2(A1) U2.12(GND) U2.21(A2) U4.2 U5.2 U6.2 U8.2
A10: CN63.3 U1.16(SCL2/TX6/A10)
A11: CN62.3 U1.17(SDA2/RX6/A11)
A12: CN61.3 U1.18(MOSI1/A12)
A13: CN60.3 U1.19(SCK1/A13)
A14: CN59.3 U1.30(INN/CS1/A14)
A15: CN58.3 U1.31(OUT1A/MISO1/A15)
A16: CN57.3 U1.32(A16)
A17: CN56.3 U1.33(A17)
BCLK2: CN50.3 U1.6(BCLK2)
CRX1: CN10.3 U1.45(CRX1/A9)
CRX3: U1.22(CRX3) U5.5
CS: U1.12(MQSR/CS) U4.6
CTX1: CN10.4 U1.44(CTX1/A8)
CTX3: U1.23(CTX3) U6.5
ECHO0: Q2.3(D) R22.1 U1.25(MCLK2)
ECHO1: Q4.3(D) R26.1 U1.27(TX8)
ECHO2: Q6.3(D) R30.1 U1.29(CS)
ECHO3: Q8.3(D) R34.1 U1.37(RX3/A1)
I2CRESET: U1.10(IN1/TX2) U2.3(RESET#)
IN2: CN51.3 U1.7(IN2)
LRCLK2: Q16.1(G) U1.5(LRCLK2)
MISO: U1.14(MQSL/MISO) U4.4 U8.4
MOSI: U1.13(CTX1/MOSI) U4.3 U8.3
OUT1A: CN53.3 U1.9(OUT1A/RX2)
OUT1C: U1.11(OUT1C) U8.6
OUT1D: CN52.3 U1.8(OUT1D)
OUT2: Q15.1(G) U1.4(OUT2)
RX1: Q13.1(G) U1.2(CRX2/CS1/RX1)
RX4: U1.38(RX4/A2) U6.3
RX5: CN13.3 U1.43(RX5/A7)
RX7: U1.20(RX7) U5.3
SCK: U1.35(SCK) U4.5 U8.5
SCL: CN11.3 CN12.3 R17.1 U1.41(A5) U2.22(SCL)
SDA: CN11.4 CN12.4 R18.1 U1.40(A4) U2.23(SDA)
TRIG0: Q1.2(S) R20.2 U1.24(OUT1B)
TRIG1: Q3.2(S) R24.2 U1.26(RX8)
TRIG2: Q5.2(S) R28.2 U1.28(CS)
TRIG3: Q7.2(S) R32.2 U1.36(TX3/A0)
TX1: Q14.1(G) U1.3(CTX2/MISO1/TX1)
TX4: U1.39(TX4/A3) U6.4
TX5: CN13.4 U1.42(TX5/A6)
TX7: U1.21(TX7) U5.4
$2N1400: CN14.4 R1.2 U2.4(SD0)
$2N1404: CN14.3 R2.2 U2.5(SC0)
$2N1409: CN15.4 R3.2 U2.6(SD1)
$2N1414: CN15.3 R4.2 U2.7(SC1)
$2N1419: CN16.4 R5.2 U2.8(SD2)
$2N1424: CN16.3 R6.2 U2.9(SC2)
$2N2020: CN18.3 R15.1 U2.14(SC4)
$2N2036: CN19.4 R14.1 U2.15(SD5)
$2N2050: CN19.3 R13.1 U2.16(SC5)
$2N2062: CN20.4 R12.1 U2.17(SD6)
$2N2072: CN20.3 R11.1 U2.18(SC6)
$2N2080: CN21.3 R9.1 U2.20(SC7)
$2N2083: CN21.4 R10.1 U2.19(SD7)
$2N2247: CN18.4 R16.1 U2.13(SD4)
$2N3196: CN17.4 R7.2 U2.10(SD3)
$2N3204: CN17.3 R8.2 U2.11(SC3)
$4N429: Q1.3(D) R19.2 SONAR0.3
$4N445: Q2.2(S) R21.1 SONAR0.4
$4N1006: Q4.2(S) R25.1 SONAR1.4
$4N1014: Q3.3(D) R23.2 SONAR1.3
$4N1413: Q5.3(D) R27.2 SONAR2.3
$4N1418: Q6.2(S) R29.1 SONAR2.4
$4N1809: Q7.3(D) R31.2 SONAR3.3
$4N1814: Q8.2(S) R33.1 SONAR3.4
$5N1727: CN3.1 Q13.3(D)
$5N1738: CN54.1 Q14.3(D)
$5N1796: CN2.1 Q15.3(D)
$5N1800: CN1.1 Q16.3(D)
$5N2083: CN50.1 CN51.1 CN52.1 CN53.1 H1.2
$5N2356: H1.3 P2.2

## Notes on the sheets
sheet 3
- Analog Inputs
- SPI Bus
- CANBUS
- I2C
- ROBOCLAW
- UART
- MISC
sheet 5
- RELAYS
- PWM

# Board PCB1
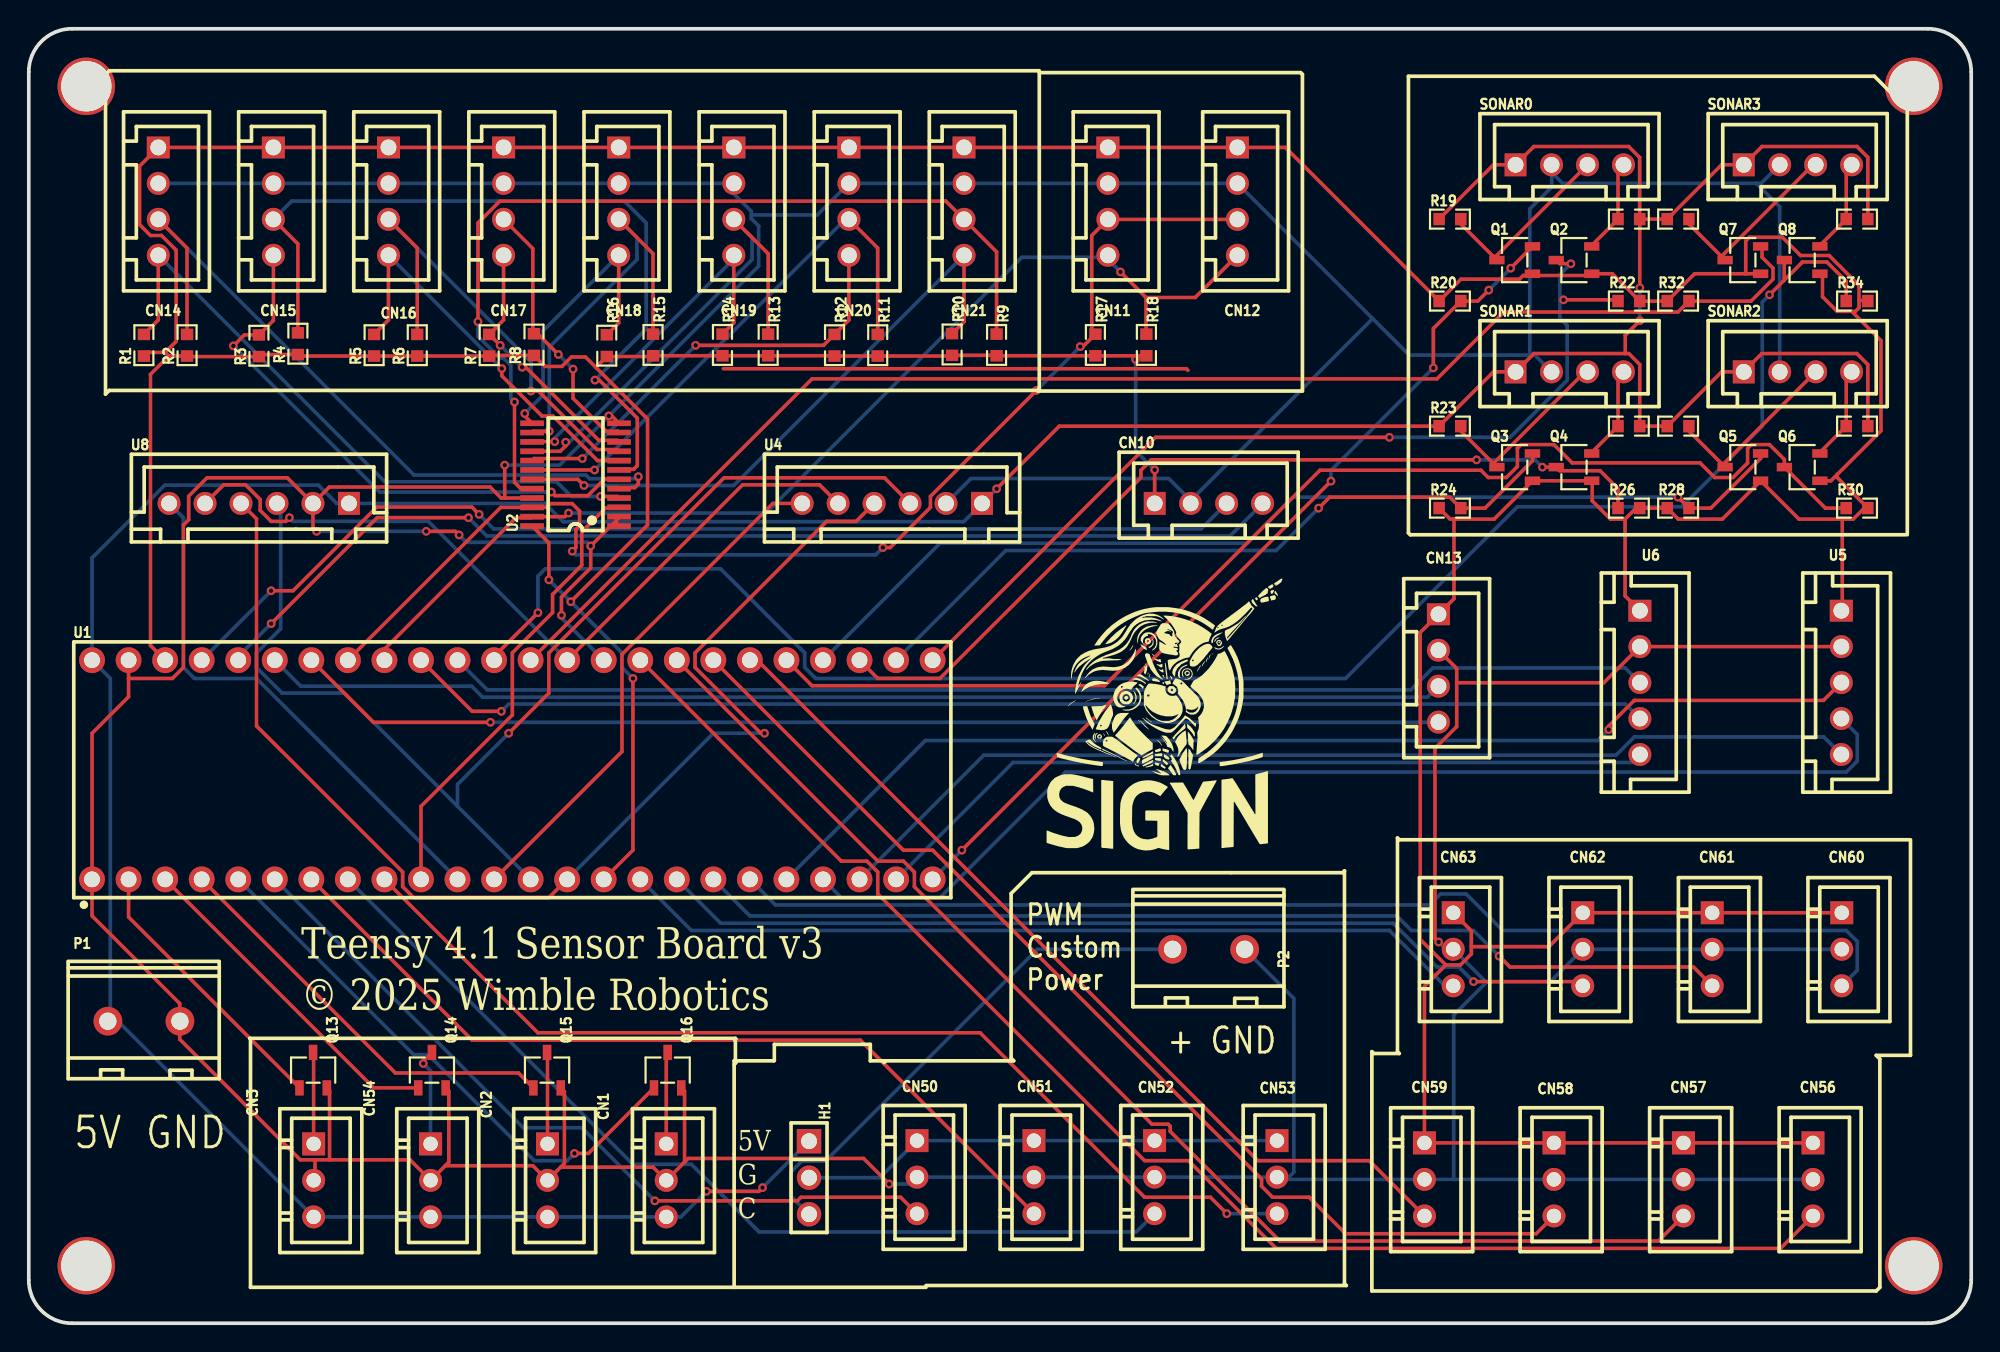
[diagram p5: board, top side]
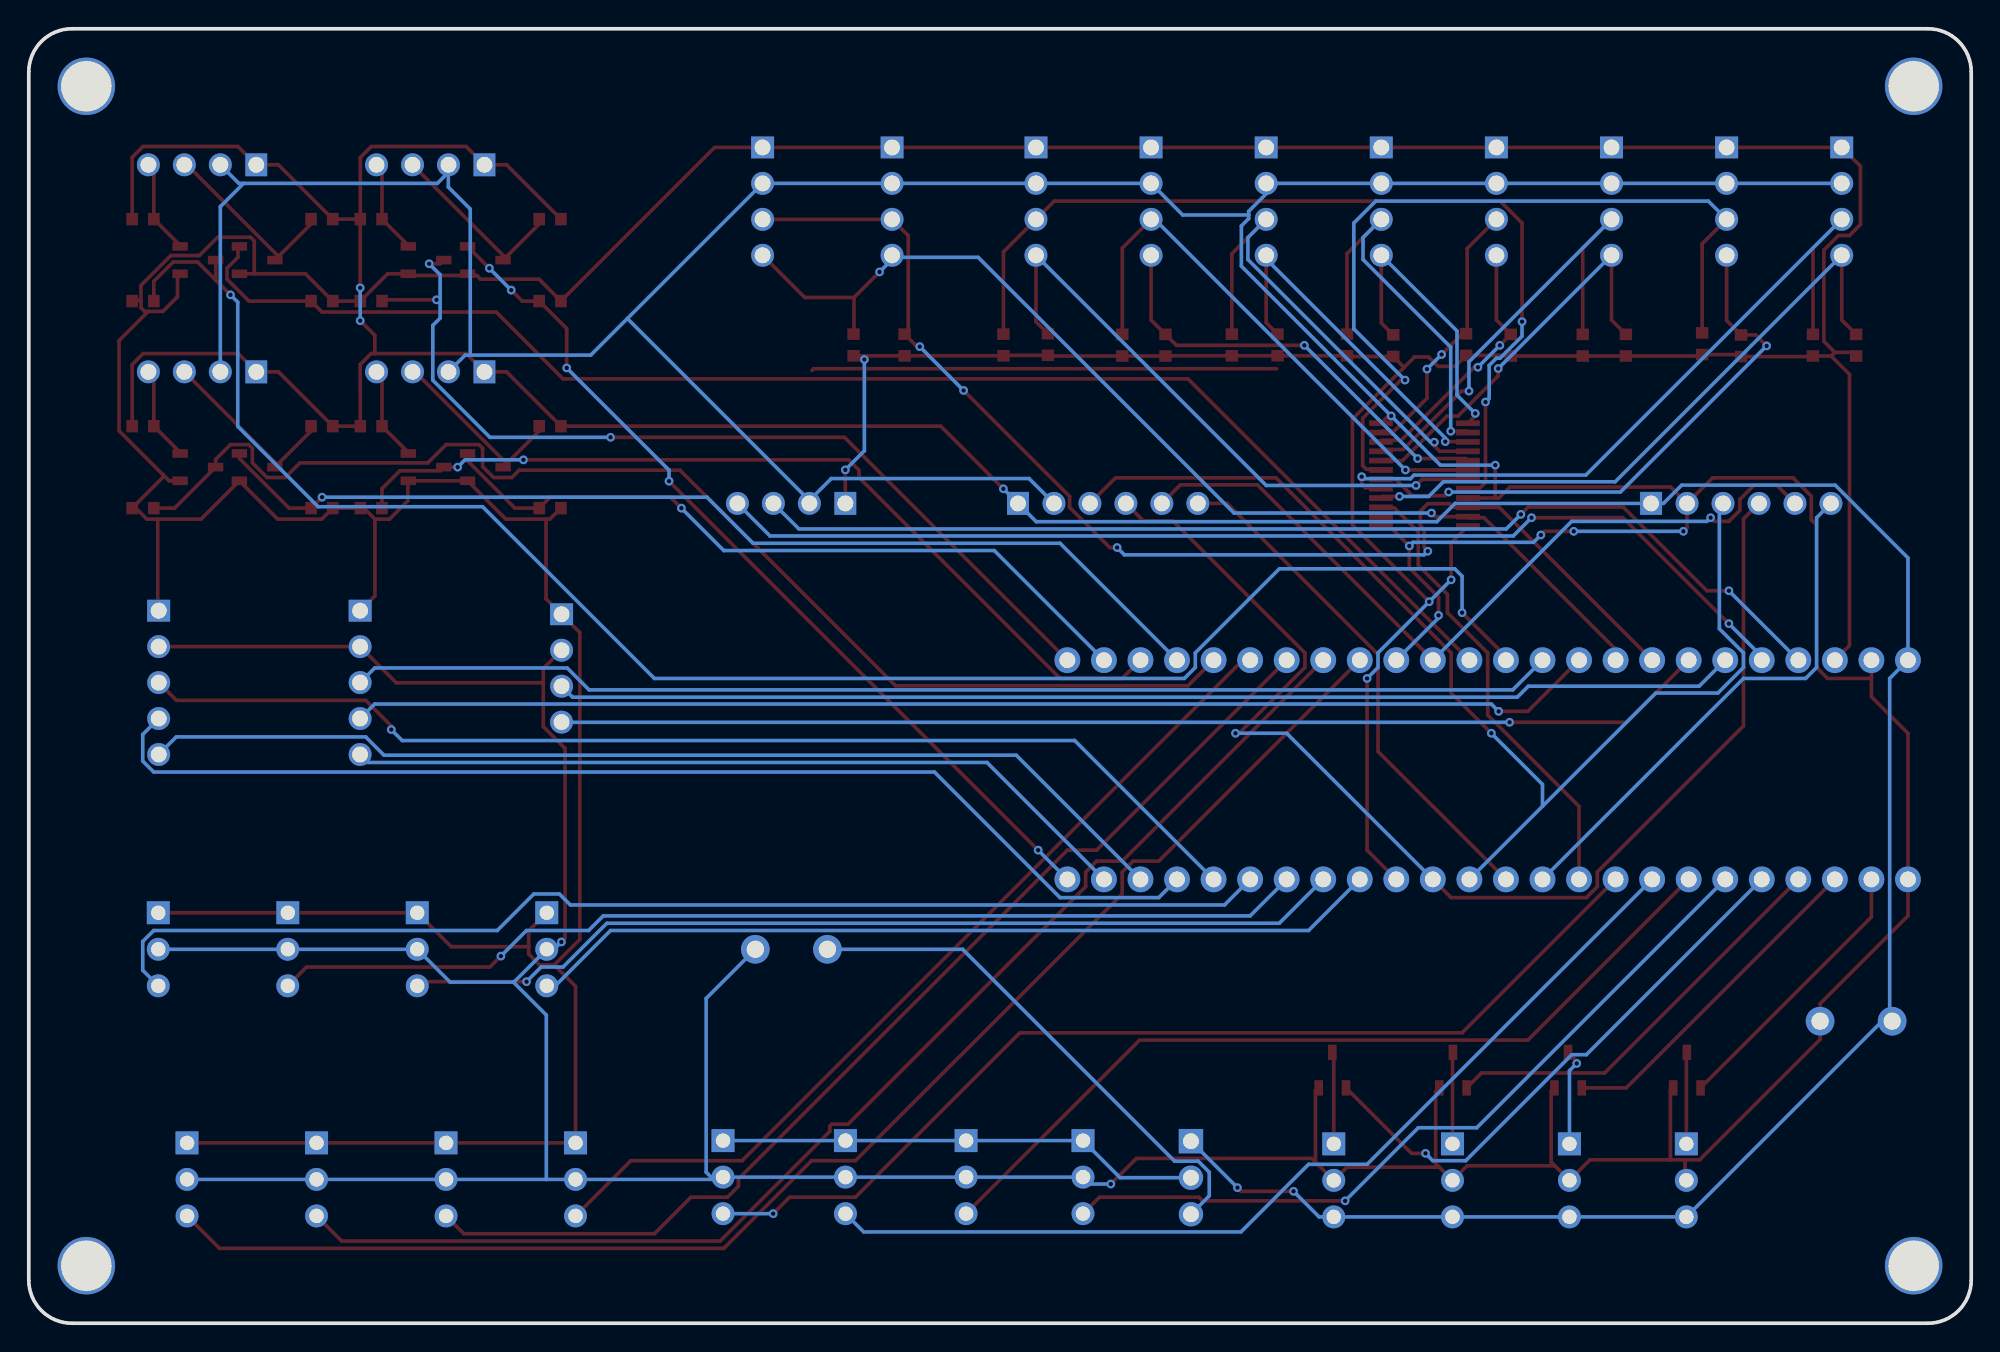
[diagram p6: board, bottom side, seen from below]

Outline 135 x 90 mm; copper layers: Top Layer, Bottom Layer. Coordinates in mm from the lower left corner of the outline.
Outline path: 0,87 0,3 arc(0.88,0.88) 3,0 132,0 arc(134.12,0.88) 135,3 135,87 arc(134.12,89.12) 132,90 3,90 arc(0.88,89.12) 0,87
Stack: Top Layer 0.035mm / Dielectric1 1.51mm FR4 er 4.5 / Bottom Layer 0.035mm

## Design rules (mm)
template: JLCPCB Capability(Two Layers Board)
spacing copperThickness1oz (default): track to track 0.102, other pairs 0.152 to 0.3
spacing copperThickness2oz: track to track 0.203, other pairs 0.152 to 0.3
track width copperThickness1oz (default): min 0.127, default 0.254, max 2.54
track width copperThickness2oz: min 0.203, default 0.254, max 2.54
differential pair differentialPair (default): width min 0.127, default 0.254, max 2.54; gap min 0.152, default 0.152
via viaSize (default): diameter min 0.5, default 0.61, max 10; hole min 0.3, default 0.305, max 6.3

## Placement (name value [footprint] x y rotation side)
CN1  ZX-XH2.54-3PZZ  [CONN-TH_3P-P2.54_2501S-3P]  44.3 9.93 270 top
CN2  ZX-XH2.54-3PZZ  [CONN-TH_3P-P2.54_2501S-3P]  36.05 9.93 270 top
CN3  ZX-XH2.54-3PZZ  [CONN-TH_3P-P2.54_2501S-3P]  19.8 9.93 270 top
CN10  ZX-XH2.54-4PZZ  [CONN-TH_4P-P2.50_4PIN]  82 57 0 top
CN11  ZX-XH2.54-4PZZ  [CONN-TH_4P-P2.50_4PIN]  75 78 270 top
CN12  ZX-XH2.54-4PZZ  [CONN-TH_4P-P2.50_4PIN]  84 78 270 top
CN13  ZX-XH2.54-4PZZ  [CONN-TH_4P-P2.50_4PIN]  97.97 45.54 270 top
CN14  ZX-XH2.54-4PZZ  [CONN-TH_4P-P2.50_4PIN]  9 78 270 top
CN15  ZX-XH2.54-4PZZ  [CONN-TH_4P-P2.50_4PIN]  17 78 270 top
CN16  ZX-XH2.54-4PZZ  [CONN-TH_4P-P2.50_4PIN]  25 78 270 top
CN17  ZX-XH2.54-4PZZ  [CONN-TH_4P-P2.50_4PIN]  33 78 270 top
CN18  ZX-XH2.54-4PZZ  [CONN-TH_4P-P2.50_4PIN]  41 78 270 top
CN19  ZX-XH2.54-4PZZ  [CONN-TH_4P-P2.50_4PIN]  49 78 270 top
CN20  ZX-XH2.54-4PZZ  [CONN-TH_4P-P2.50_4PIN]  57 78 270 top
CN21  ZX-XH2.54-4PZZ  [CONN-TH_4P-P2.50_4PIN]  65 78 270 top
CN50  ZX-XH2.54-3PZZ  [CONN-TH_3P-P2.54_2501S-3P]  61.73 10.16 270 top
CN51  ZX-XH2.54-3PZZ  [CONN-TH_3P-P2.54_2501S-3P]  69.86 10.16 270 top
CN52  ZX-XH2.54-3PZZ  [CONN-TH_3P-P2.54_2501S-3P]  78.24 10.16 270 top
CN53  ZX-XH2.54-3PZZ  [CONN-TH_3P-P2.54_2501S-3P]  86.75 10.16 270 top
CN54  ZX-XH2.54-3PZZ  [CONN-TH_3P-P2.54_2501S-3P]  27.92 9.93 270 top
CN56  ZX-XH2.54-3PZZ  [CONN-TH_3P-P2.54_2501S-3P]  124 10 270 top
CN57  ZX-XH2.54-3PZZ  [CONN-TH_3P-P2.54_2501S-3P]  115 10 270 top
CN58  ZX-XH2.54-3PZZ  [CONN-TH_3P-P2.54_2501S-3P]  106 10 270 top
CN59  ZX-XH2.54-3PZZ  [CONN-TH_3P-P2.54_2501S-3P]  97 10 270 top
CN60  ZX-XH2.54-3PZZ  [CONN-TH_3P-P2.54_2501S-3P]  126 26 270 top
CN61  ZX-XH2.54-3PZZ  [CONN-TH_3P-P2.54_2501S-3P]  117 26 270 top
CN62  ZX-XH2.54-3PZZ  [CONN-TH_3P-P2.54_2501S-3P]  108 26 270 top
CN63  ZX-XH2.54-3PZZ  [CONN-TH_3P-P2.54_2501S-3P]  99 26 270 top
H1  PZ254V-11-03P  [HDR-TH_3P-P2.54-V-M]  54.23 10.12 270 top
P1  WJ127-5.0-2P  [CONN-TH_2P-P5.00_CPC3703CTR]  8 21 180 top
P2  WJ127-5.0-2P  [CONN-TH_2P-P5.00_CPC3703CTR]  82 26 180 top
Q1  BSS138  [SOT-23-3_L2.9-W1.6-P1.90-LS2.8-BR]  103.27 73.92 0 top
Q2  BSS138  [SOT-23-3_L2.9-W1.6-P1.90-LS2.8-BR]  107.39 73.92 0 top
Q3  BSS138  [SOT-23-3_L2.9-W1.6-P1.90-LS2.8-BR]  103.27 59.52 0 top
Q4  BSS138  [SOT-23-3_L2.9-W1.6-P1.90-LS2.8-BR]  107.39 59.52 0 top
Q5  BSS138  [SOT-23-3_L2.9-W1.6-P1.90-LS2.8-BR]  119.13 59.52 0 top
Q6  BSS138  [SOT-23-3_L2.9-W1.6-P1.90-LS2.8-BR]  123.25 59.52 0 top
Q7  BSS138  [SOT-23-3_L2.9-W1.6-P1.90-LS2.8-BR]  119.13 73.92 0 top
Q8  BSS138  [SOT-23-3_L2.9-W1.6-P1.90-LS2.8-BR]  123.25 73.92 0 top
Q13  BSS138  [SOT-23-3_L2.9-W1.6-P1.90-LS2.8-BR]  19.76 17.6 270 top
Q14  BSS138  [SOT-23-3_L2.9-W1.6-P1.90-LS2.8-BR]  28.02 17.6 270 top
Q15  BSS138  [SOT-23-3_L2.9-W1.6-P1.90-LS2.8-BR]  36.02 17.6 270 top
Q16  BSS138  [SOT-23-3_L2.9-W1.6-P1.90-LS2.8-BR]  44.4 17.6 270 top
R1  3kΩ  [R0603]  8 68 90 top
R2  3kΩ  [R0603]  11 68 90 top
R3  3kΩ  [R0603]  16 67.96 90 top
R4  3kΩ  [R0603]  18.7 68.1 90 top
R5  3kΩ  [R0603]  24 68 90 top
R6  3kΩ  [R0603]  27 68 90 top
R7  3kΩ  [R0603]  32 68 90 top
R8  3kΩ  [R0603]  35.11 68.04 90 top
R9  3kΩ  [R0603]  67.26 68.02 270 top
R10  3kΩ  [R0603]  64.17 68.05 270 top
R11  3kΩ  [R0603]  59 68 270 top
R12  3kΩ  [R0603]  56 68 270 top
R13  3kΩ  [R0603]  51.39 68.02 270 top
R14  3kΩ  [R0603]  48.21 68.02 270 top
R15  3kΩ  [R0603]  43.39 68.02 270 top
R16  3kΩ  [R0603]  40.17 67.97 270 top
R17  3kΩ  [R0603]  74.13 68.01 270 top
R18  3kΩ  [R0603]  77.68 68.02 270 top
R19  10kΩ  [R0603]  98.77 76.77 0 top
R20  10kΩ  [R0603]  98.77 71.07 0 top
R21  10kΩ  [R0603]  111.21 76.77 0 top
R22  10kΩ  [R0603]  111.21 71.07 0 top
R23  10kΩ  [R0603]  98.77 62.37 0 top
R24  10kΩ  [R0603]  98.77 56.67 0 top
R25  10kΩ  [R0603]  111.21 62.37 0 top
R26  10kΩ  [R0603]  111.21 56.67 0 top
R27  10kΩ  [R0603]  114.63 62.37 0 top
R28  10kΩ  [R0603]  114.63 56.67 0 top
R29  10kΩ  [R0603]  127.06 62.37 0 top
R30  10kΩ  [R0603]  127.06 56.67 0 top
R31  10kΩ  [R0603]  114.63 76.77 0 top
R32  10kΩ  [R0603]  114.63 71.07 0 top
R33  10kΩ  [R0603]  127.06 76.77 0 top
R34  10kΩ  [R0603]  127.06 71.07 0 top
SONAR0  ZX-XH2.54-4PZZ  [CONN-TH_4P-P2.50_4PIN]  107.08 80.54 0 top
SONAR1  ZX-XH2.54-4PZZ  [CONN-TH_4P-P2.50_4PIN]  107.08 66.15 0 top
SONAR2  ZX-XH2.54-4PZZ  [CONN-TH_4P-P2.50_4PIN]  122.94 66.15 0 top
SONAR3  ZX-XH2.54-4PZZ  [CONN-TH_4P-P2.50_4PIN]  122.94 80.54 0 top
U1  Teensy USB Board, Version 4.1  [COMM-TH_L61.0-W17.8-P2.54]  33.61 38.48 0 top
U2  TCA9548APWR  [TSSOP-24_L7.8-W4.4-P0.65-LS6.4-BL]  38 59 90 top
U4  ZX-XH2.54-6PZZ  [CONN-TH_6P-P2.50_ZX-XH2.54-6PZZ]  60 57 0 top
U5  ZX-XH2.54-5PZZ  [CONN-TH_5P-P2.50_ZX-XH2.54-5PZZ]  125.97 44.54 270 top
U6  ZX-XH2.54-5PZZ  [CONN-TH_5P-P2.50_ZX-XH2.54-5PZZ]  111.97 44.54 270 top
U8  ZX-XH2.54-6PZZ  [CONN-TH_6P-P2.50_ZX-XH2.54-6PZZ]  16 57 0 top
U12  -  [3.5mm_Hole#2]  133.83 -4.84 0 top
U13  -  [3.5mm_Hole]  150.72 79.12 0 top
U14  -  [3.5mm_Hole#4]  -7.02 56.33 0 top
U15  -  [3.5mm_Hole#3]  -7.02 -9.71 0 top

## Footprints (pads in the part's own frame, mm; a bottom-side part is the same pattern mirrored in y, then rotated)
3.5mm_Hole
  round 4 hole 3.5: 3(-19.717,6.877)
3.5mm_Hole#2
  round 4 hole 3.5: 3(-2.826,8.841)
3.5mm_Hole#3
  round 4 hole 3.5: 3(11.017,13.714)
3.5mm_Hole#4
  round 4 hole 3.5: 3(11.017,29.674)
COMM-TH_L61.0-W17.8-P2.54
  round 1.8 hole 1.1: 1(-29.21,-7.62) 2(-26.67,-7.62) 3(-24.13,-7.62) 4(-21.59,-7.62) 5(-19.05,-7.62) 6(-16.51,-7.62) 7(-13.97,-7.62) 8(-11.43,-7.62) 9(-8.89,-7.62) 10(-6.35,-7.62) 11(-3.81,-7.62) 12(-1.27,-7.62) 13(1.27,-7.62) 14(3.81,-7.62) 15(6.35,-7.62) 16(8.89,-7.62) 17(11.43,-7.62) 18(13.97,-7.62) 19(16.51,-7.62) 20(19.05,-7.62) 21(21.59,-7.62) 22(24.13,-7.62) 23(26.67,-7.62) 24(29.21,-7.62) 25(29.21,7.62) 26(26.67,7.62) 27(24.13,7.62) 28(21.59,7.62) 29(19.05,7.62) 30(16.51,7.62) 31(13.97,7.62) 32(11.43,7.62) 33(8.89,7.62) 34(6.35,7.62) 35(3.81,7.62) 36(1.27,7.62) 37(-1.27,7.62) 38(-3.81,7.62) 39(-6.35,7.62) 40(-8.89,7.62) 41(-11.43,7.62) 42(-13.97,7.62) 43(-16.51,7.62) 44(-19.05,7.62) 45(-21.59,7.62) 46(-24.13,7.62) 47(-26.67,7.62) 48(-29.21,7.62)
CONN-TH_2P-P5.00_CPC3703CTR
  round 2 hole 1.2: 1(-2.505,0) 2(2.505,0)
CONN-TH_3P-P2.54_2501S-3P
  rect 1.6x1.6 hole 1: 1(-2.54,0)
  round 1.6 hole 1: 2(0,0) 3(2.54,0)
CONN-TH_4P-P2.50_4PIN
  rect 1.524x1.6 hole 1.1: 1(-3.75,0)
  round 1.6 hole 1.1: 2(-1.25,0) 3(1.25,0) 4(3.75,0)
CONN-TH_5P-P2.50_ZX-XH2.54-5PZZ
  rect 1.524x1.6 hole 1.1: 1(-5,0)
  round 1.6 hole 1.1: 2(-2.5,0) 3(0,0) 4(2.5,0) 5(5,0)
CONN-TH_6P-P2.50_ZX-XH2.54-6PZZ
  rect 1.524x1.6 hole 1.1: 1(6.25,0)
  round 1.6 hole 1.1: 2(3.75,0) 3(1.25,0) 4(-1.25,0) 5(-3.75,0) 6(-6.25,0)
HDR-TH_3P-P2.54-V-M
  rect 1.7x1.7 hole 1.1: 1(-2.54,0)
  round 1.7 hole 1.1: 2(0,0) 3(2.54,0)
R0603
  rect 0.806x0.864 smd: 1(-0.753,0) 2(0.753,0)
SOT-23-3_L2.9-W1.6-P1.90-LS2.8-BR
  rect 1.07x0.6 smd: 1(1.235,-0.95) 2(1.235,0.95) 3(-1.235,0)
TSSOP-24_L7.8-W4.4-P0.65-LS6.4-BL
  rect 0.4x1.65 smd: 1(-3.575,-3.022) 2(-2.925,-3.022) 3(-2.275,-3.022) 4(-1.625,-3.022) 5(-0.975,-3.022) 6(-0.325,-3.022) 7(0.325,-3.022) 8(0.975,-3.022) 9(1.625,-3.022) 10(2.275,-3.022) 11(2.925,-3.022) 12(3.575,-3.022) 13(3.575,3.022) 14(2.925,3.022) 15(2.275,3.022) 16(1.625,3.022) 17(0.975,3.022) 18(0.325,3.022) 19(-0.325,3.022) 20(-0.975,3.022) 21(-1.625,3.022) 22(-2.275,3.022) 23(-2.925,3.022) 24(-3.575,3.022)

## Nets
As in the schematic.

Pads without a net: U12 3; U13 3; U14 3; U15 3

## Via types
v1: diameter 0.61, hole 0.305, Top Layer to Bottom Layer, 76 vias

## Routing (per net, layer and track width the routed paths; a pad name or vN(x,y) marks a point on that pad's centre or on a via; arc(x,y) is an arc through that point)
3.3V: length 478.4
  Top Layer w0.254: 39.45,66.42 39.45,66.49 R16.2 43.34,67.21 R15.2 R14.2 R13.2 55.98,67.26 R12.2 R11.2 64.12,67.25 R10.2 67.23,67.3 R9.2 74.13,67.26 ; 39.45,66.42 38.69,67.18 37.71,67.18 37.06,66.53 35.87,66.53 R8.1 32.04,67.29 R7.1 R6.1 R5.1 18.81,67.25 R4.1 16.14,67.35 16,67.21 11.04,67.21 R2.1 9.73,67.25 ; 39.45,66.42 43,62.86 43,55.5 v1(37.67,50.16) ; 9.48,67.5 8.25,67.5 R1.1 ; 9.48,67.5 10.24,68.26 10.24,74.61 9.22,75.63 8.46,75.63 7.7,76.39 7.7,80.45 CN14.1 CN15.1 CN16.1 CN17.1 CN18.1 CN19.1 CN20.1 CN21.1 CN11.1 CN12.1 87.33,81.75 R20.1 99.54,72.59 103.6,72.59 103.86,72.84 104.37,72.84 ; 9.48,67.5 9.73,67.25 ; 99.05,55.91 99.05,50.37 CN13.1 96.7,48.02 96.7,26.69 98.48,24.91 ; 99.05,55.91 98.78,55.91 R24.1 ; 99.05,55.91 101.84,55.91 Q3.1 Q4.1 108.66,58.54 108.66,57.18 109.93,55.91 110.94,55.91 ; Q6.1 125.25,58.57 125.68,59 ; 98.48,24.91 97,23.43 CN59.1 CN58.1 CN57.1 CN56.1 ; 98.48,24.91 99.5,24.91 100.26,25.67 100.26,26.18 ; 126.04,55.91 126.04,49.61 U5.1 ; 126.04,55.91 126.8,55.91 127.56,56.67 R30.2 125.68,58.81 125.68,59 ; 126.04,55.91 123.03,55.91 Q5.1 117.7,55.91 114.64,55.91 R28.1 R26.2 111.7,56.67 110.94,55.91 ; 126.7,70.35 126.95,70.35 127.2,70.6 127.2,71.11 ; 126.7,70.35 125.68,70.35 124.66,71.37 124.66,72.79 Q8.1 ; 126.7,70.35 128.73,68.32 128.73,62.05 125.68,59 ; 127.2,71.11 127.2,72.16 125.12,74.24 123.14,74.24 121.87,75.51 119.58,75.51 119.33,75.25 119.33,72.97 ; 127.2,71.11 127.77,71.11 R34.2 ; 119.33,72.97 Q7.1 ; 119.33,72.97 115.77,72.97 R32.1 R22.2 110.06,72.97 Q2.1 108.51,72.84 104.37,72.84 ; 76.92,67.26 77.67,67.26 ; 76.92,67.26 v1(76.92,67.01) ; 76.92,67.26 R17.2 ; CN60.1 CN61.1 CN62.1 105.64,26.18 100.26,26.18 ; U1.15 41.99,32.89 v1(41.99,44.83) ; U2.24 36.15,54.26 v1(36.15,51.69) ; 110.94,55.91 110.94,50.57 U6.1 ; 104.37,72.84 Q1.1 ; 100.26,26.18 100.26,27.28 CN63.1 ; v1(78.25,59.33) CN10.1 ; 9.73,67.25 8.46,65.98 8.46,47.12 U1.46
  Bottom Layer w0.254: v1(36.15,51.69) v1(37.67,50.16) 41.23,46.61 41.23,45.59 v1(41.99,44.83) ; v1(76.92,67.01) 76.92,60.66 v1(78.25,59.33)
5V: length 285
  Top Layer w0.254: 110.95,67.42 110.95,68.69 v1(111.97,69.7) ; 110.95,67.42 111.21,67.42 111.97,66.66 R25.2 R27.1 117.65,66.15 119.18,66.15 ; 110.95,67.42 104.6,67.42 SONAR1.1 101.79,66.15 R23.1 71.62,62.37 v1(67.27,58.02) ; R19.1 101.79,80.54 SONAR0.1 104.6,81.81 111.2,81.81 111.96,81.05 R21.2 ; R29.2 127.82,66.65 127.05,67.42 120.44,67.42 119.18,66.15 ; 119.18,66.15 SONAR2.1 ; R21.2 111.97,76.76 v1(111.97,71.99) ; R21.2 R31.1 117.65,80.54 SONAR3.1 120.46,81.81 127.06,81.81 127.82,81.06 R33.2 ; v1(51,9.43) 50.74,9.17 v1(47.1,9.17)
  Bottom Layer w0.254: v1(111.97,69.7) v1(111.97,71.99) ; v1(51,9.43) H1.1 ; v1(47.1,9.17) 45.32,7.39 CN1.3 CN2.3 CN54.3 CN3.3 6.19,21 P1.2 5.67,21.17 5.67,44.83 U1.48 4.4,53.21 9.45,58.27 20.12,58.27 21.39,57 U8.1 35.87,57 37.14,55.73 64.98,55.73 U4.1 v1(67.27,58.02)
GND: length 578.5
  Top Layer w0.254: 19.89,11.36 20.91,11.36 ; 19.89,11.36 19.89,10.03 CN3.2 ; 19.89,11.36 18.88,11.36 10.49,19.74 10.49,21.01 ; 20.91,11.36 20.91,16.17 Q13.2 ; 20.91,11.36 26.5,11.36 CN54.2 28.94,10.95 ; U8.2 17.97,58.78 12.38,58.78 11.11,57.51 11.11,55.87 10.75,55.5 10.75,45.59 9.98,44.83 6.94,44.83 ; U8.2 20.89,58.14 32.06,58.14 32.83,57.38 33.08,57.38 ; U8.2 19.75,55.31 v1(20,55.06) ; 33.08,57.38 U2.21 ; 33.08,57.38 v1(33.08,59.66) ; 45.57,11.2 45.57,16.14 Q16.2 ; 45.57,11.2 CN1.2 43.39,10.85 36.97,10.85 ; 45.57,11.2 45.83,11.46 58.02,11.46 v1(59.8,9.68) ; 28.94,10.95 35.03,10.95 CN2.2 36.97,10.85 ; 28.94,10.95 29.19,11.2 29.19,16.14 28.97,16.36 ; CN13.2 99.24,45.52 99.24,44.53 ; 6.94,44.83 6.94,43.56 4.4,41.02 U1.1 4.4,28.32 10.49,22.22 10.49,21.01 ; 6.94,44.83 U1.47 ; 99.24,44.53 99.24,41.48 97.73,39.97 97.73,26.76 v1(97.98,26.51) ; 99.24,44.53 109.46,44.53 U6.2 U5.2 ; Q15.2 37.22,16.11 37.22,11.11 36.97,10.85 ; 40.83,55.82 40.83,55.62 U2.1 ; 40.83,55.82 41.02,56.01 U2.2 ; 40.83,55.82 v1(39.05,54.04) 39.05,52.52 37.02,50.49 v1(37.02,49.22) ; U2.12 40.51,63.08 v1(40.31,63.08) ; 10.49,21.01 P1.1 ; v1(27.62,55.06) 29.66,55.06 v1(29.91,54.81)
  Bottom Layer w0.254: 80.75,57.2 CN10.2 ; 80.75,57.2 79.23,58.73 65.48,58.73 U4.2 ; 80.75,57.2 93.4,69.85 ; 120.07,79.25 121.69,77.63 SONAR2.2 ; 120.07,79.25 120.4,79.25 SONAR3.2 ; 120.07,79.25 106.61,79.25 105.84,80.01 ; 50.22,77.05 50.22,76.8 50.72,76.29 50.72,73.5 v1(40.31,63.08) 36.89,59.66 v1(33.08,59.66) ; 50.22,77.05 54.8,77.05 CN20.2 CN21.2 CN11.2 CN12.2 93.4,69.85 ; 50.22,77.05 50.22,77.31 48.69,78.83 ; 93.4,69.85 95.94,67.31 104.32,67.31 ; v1(39.05,54.04) 38.8,54.3 30.42,54.3 v1(29.91,54.81) ; 48.69,78.83 48.69,78.94 CN19.2 ; 48.69,78.83 48.27,79.25 CN18.2 CN17.2 CN16.2 CN15.2 CN14.2 ; 99.03,10 99.03,21.43 101.32,23.72 ; 99.03,10 CN58.2 CN57.2 CN56.2 ; 99.03,10 CN59.2 87.42,10 ; 87.42,10 87.92,10.51 87.92,22.58 P2.1 ; 87.42,10 86.91,10 CN53.2 CN52.2 CN51.2 CN50.2 61.25,9.68 v1(59.8,9.68) ; 105.84,80.01 105.84,80.53 SONAR0.2 ; 105.84,80.01 105.84,79 104.32,77.47 104.32,67.31 ; SONAR1.2 104.67,67.31 104.32,67.31 ; CN60.2 CN61.2 CN62.2 105.72,23.72 101.32,23.72 ; 101.32,23.72 101.28,23.72 CN63.2 98.49,26 v1(97.98,26.51) ; v1(37.02,49.22) 37.02,49.04 U1.34 ; v1(20,55.06) v1(27.62,55.06)
A10: length 59.6
  Bottom Layer w0.254: CN63.3 98.41,23.46 94.57,27.3 46.05,27.3 U1.16
A11: length 66
  Top Layer w0.254: v1(100.41,23.75) 107.71,23.75 CN62.3
  Bottom Layer w0.254: U1.17 48.08,27.81 94.82,27.81 97.87,24.76 99.39,24.76 v1(100.41,23.75)
A12: length 72.5
  Top Layer w0.254: v1(102.19,25.53) 102.95,24.76 115.7,24.76 CN61.3
  Bottom Layer w0.254: v1(102.19,25.53) 100.41,27.3 96.09,27.3 95.07,28.32 50.12,28.32 U1.18
A13: length 82.9
  Bottom Layer w0.254: CN60.3 127.08,24.54 127.08,26.54 126.32,27.3 102.44,27.3 99.9,29.84 98.12,29.84 97.36,29.08 51.9,29.08 U1.19
A14: length 62.9
  Top Layer w0.254: U1.30 50.62,46.1 85.42,11.3 93.16,11.3 CN59.3
A15: length 75.8
  Top Layer w0.254: U1.31 60.78,32.89 62.82,32.89 85.68,10.03 85.68,9.52 86.44,8.76 88.98,8.76 91.52,6.22 104.76,6.22 CN58.3
A16: length 88.2
  Top Layer w0.254: CN57.3 113.25,5.71 86.95,5.71 79.33,13.33 79.33,13.7 79.18,13.84 78.06,13.84 61.55,30.35 61.55,31.37 60.78,32.13 59.01,32.13 U1.32
A17: length 100.3
  Top Layer w0.254: CN56.3 121.75,5.21 86.69,5.21 80.6,11.3 77.55,11.3 59.01,29.84 59.01,31.37 58.25,32.13 56.47,32.13 U1.33
BCLK2: length 54.5
  Top Layer w0.254: CN50.3 60.59,8.76 53.67,8.76 53.42,8.51 v1(43.51,8.51)
  Bottom Layer w0.254: v1(43.51,8.51) 38.43,13.59 34.37,13.59 U1.6
CRX1: length 77
  Top Layer w0.254: v1(31.3,56.24) 30.79,56.75 24.19,56.75 18.37,50.93 v1(16.84,50.93)
  Bottom Layer w0.254: CN10.3 81.47,55.22 32.31,55.22 v1(31.3,56.24) ; U1.45 v1(16.84,50.93)
CRX3: length 72.8
  Bottom Layer w0.254: U5.5 124.75,40.77 111.59,40.77 110.31,39.5 66.37,39.5 U1.22
CS: length 36.2
  Top Layer w0.254: U4.6 51.72,57 41.23,46.51 41.23,39.75 U1.12
CTX1: length 76.9
  Top Layer w0.254: v1(16.84,48.64) 24.21,56.01 v1(30.56,56.01)
  Bottom Layer w0.254: U1.44 14.56,46.35 v1(16.84,48.64) ; CN10.4 83.49,54.74 31.83,54.74 v1(30.56,56.01)
CTX3: length 55.3
  Bottom Layer w0.254: U1.23 68.41,38.99 111.42,38.99 U6.5
ECHO0: length 66
  Top Layer w0.254: v1(107.17,73.66) 106.41,73.66 Q2.3 ; R22.1 110.37,71.15 v1(106.67,71.15) ; v1(94.57,61.59) 78.31,61.59 U1.25
  Bottom Layer w0.254: v1(94.57,61.59) 102.95,61.59 106.92,65.56 106.92,69.38 106.41,69.88 106.41,71.15 ; 106.41,71.15 v1(106.67,71.15) ; 106.41,71.15 106.41,72.9 v1(107.17,73.66)
ECHO1: length 62
  Top Layer w0.254: v1(100.62,60.03) 78.02,60.03 77.29,59.31 77.29,58.8 63.32,44.83 59.01,44.83 U1.27 ; R26.1 110.45,58.02 109.21,59.27 106.41,59.27 Q4.3 v1(105.19,59.52)
  Bottom Layer w0.254: v1(105.19,59.52) 104.69,60.03 v1(100.62,60.03)
ECHO2: length 87.1
  Top Layer w0.254: U1.29 54.44,44.32 74.75,44.32 89.74,59.31 100.92,59.31 101.43,58.8 102.69,58.8 103.46,59.56 103.46,60.83 103.71,61.09 106,61.09 107.27,59.82 116.16,59.82 117.17,58.8 118.44,58.8 119.46,59.82 119.46,60.83 119.71,61.09 120.98,61.09 122.01,60.05 Q6.3 124.86,56.67 R30.1
ECHO3: length 122.4
  Top Layer w0.254: Q8.3 122,73.9 122,72.52 ; v1(120.98,71.5) 122,72.52 ; 122,72.52 123.27,73.79 124.96,73.79 126.31,72.44 R34.1 ; v1(35.39,49.4) 32.34,46.35 U1.37
  Bottom Layer w0.254: v1(35.39,49.4) 35.39,51.94 35.89,52.45 48.08,52.45 53.93,46.61 53.93,45.59 54.69,44.83 91.52,44.83 103.46,56.77 114.89,56.77 120.47,62.36 120.47,70.99 v1(120.98,71.5)
I2CRESET: length 32.1
  Top Layer w0.254: U2.3 40.97,56.68 40.08,56.68 38.43,55.02 38.43,52.7 36.4,50.67 36.4,49.4 33.61,46.61 33.61,42.29 27.26,35.94 U1.10
IN2: length 59.8
  Top Layer w0.254: CN51.3 57.79,19.68 30.81,19.68 U1.7
LRCLK2: length 39.1
  Top Layer w0.254: v1(37.92,11.81) 38.9,11.81 Q16.1
  Bottom Layer w0.254: v1(37.92,11.81) 37.42,11.3 35.13,11.3 27.77,18.67 26.75,18.67 U1.5
MISO: length 86
  Top Layer w0.254: U8.4 15.83,55.92 15.83,41.53 25.99,31.37 25.99,30.35 26.75,29.59 36.15,29.59 U1.14 ; U4.4 57.5,55.75 55.45,55.75 46.31,46.61 46.31,45.59 50.88,41.02 v1(51.13,41.02)
  Bottom Layer w0.254: v1(51.13,41.02) 47.58,41.02 U1.14
MOSI: length 81.5
  Top Layer w0.254: v1(33.35,41.02) 36.15,43.81 36.15,46.61 48.32,58.78 59.47,58.78 U4.3
  Bottom Layer w0.254: U1.13 29.8,35.94 ; 29.8,35.94 21.92,43.81 17.61,43.81 15.83,45.59 15.83,46.61 17.5,48.29 17.5,56.75 U8.3 ; 29.8,35.94 29.8,37.46 v1(33.35,41.02)
OUT1A: length 71.7
  Top Layer w0.254: U1.9 35.39,20.19 66.12,20.19 77.55,8.76 82.12,8.76 v1(83.27,7.62)
  Bottom Layer w0.254: v1(83.27,7.62) CN53.3
OUT1C: length 37
  Bottom Layer w0.254: U8.6 10.75,56 10.75,45.59 11.51,44.83 15.83,44.83 U1.11
OUT1D: length 66.7
  Bottom Layer w0.254: CN52.3 76.97,6.35 50.75,6.35 46.05,11.05 41.99,11.05 U1.8
OUT2: length 29.1
  Top Layer w0.254: U1.4 25.48,17.4 34.03,17.4 Q15.1
RX1: length 19.4
  Top Layer w0.254: U1.2 6.94,28.24 Q13.1
RX4: length 84.1
  Bottom Layer w0.254: U6.3 110.96,45.56 97.58,45.56 96.06,44.03 31.86,44.03 U1.38
RX5: length 82.3
  Bottom Layer w0.254: U1.43 18.91,44.29 30.78,44.29 31.54,43.53 97.21,43.53 CN13.3
RX7: length 79.1
  Top Layer w0.254: v1(109.81,41.27) 109.81,41.53 111.59,43.31 124.74,43.31 U5.3
  Bottom Layer w0.254: v1(109.81,41.27) 109.04,40.51 62.31,40.51 U1.20
SCK: length 55.8
  Top Layer w0.254: U8.5 13.54,58.29 15.06,58.29 16.08,57.28 16.08,56.51 16.84,55.75 17.86,55.75 v1(18.11,56.01) ; U4.5 54.96,58.29 49.61,58.29 U1.35
  Bottom Layer w0.254: U1.35 27.77,55.75 18.37,55.75 v1(18.11,56.01)
SCL: length 84.6
  Top Layer w0.254: CN12.3 CN11.3 73.88,75.63 73.88,69.02 R17.1 73.26,67.9 v1(73.08,67.9) ; v1(59.36,53.93) 59.87,53.93 62.66,56.72 62.66,57.49 v1(70.03,64.85) ; U1.41 32.8,56.72 U2.22 35.99,56.72 36.25,56.98 37.77,56.98 38.28,56.47 38.28,55.45 38.03,55.2 38.03,53.93 v1(37.77,53.68)
  Bottom Layer w0.254: v1(59.36,53.93) 58.85,53.42 38.03,53.42 v1(37.77,53.68) ; v1(70.03,64.85) v1(73.08,67.9)
SDA: length 76.5
  Top Layer w0.254: U1.40 24.72,46.86 33.86,56.01 34.91,56.01 U2.23 37.26,56.08 v1(37.52,56.33) ; v1(75.87,73.09) 77.65,71.31 ; 77.65,71.31 81.07,71.31 CN12.4 ; 77.65,71.31 77.65,68.8 R18.1
  Bottom Layer w0.254: 74.86,74.11 CN11.4 ; 74.86,74.11 69.01,74.11 51.23,56.33 v1(37.52,56.33) ; 74.86,74.11 v1(75.87,73.09)
TRIG0: length 62
  Top Layer w0.254: v1(64.85,32.89) v1(90.5,58.55) ; v1(102.99,73.35) Q1.2 ; v1(101.47,71.83) 100.71,71.07 R20.2 97.62,69.16 v1(97.62,66.42)
  Bottom Layer w0.254: v1(97.62,66.42) 90.5,59.31 v1(90.5,58.55) ; U1.24 v1(64.85,32.89) ; v1(101.47,71.83) v1(102.99,73.35)
TRIG1: length 51.1
  Top Layer w0.254: Q3.2 104.51,59.96 101.22,56.67 R24.2 98.76,57.43 90.41,57.43 v1(89.64,56.67)
  Bottom Layer w0.254: v1(89.64,56.67) 86.69,53.72 67.9,53.72 U1.26
TRIG2: length 72
  Top Layer w0.254: Q5.2 120.36,60.13 116.91,56.67 R28.2 v1(114.62,57.43)
  Bottom Layer w0.254: U1.28 63.32,54.23 84.66,54.23 87.87,57.43 v1(114.62,57.43)
TRIG3: length 100
  Top Layer w0.254: Q7.2 120.46,74.77 120.46,74.11 121.22,73.35 121.22,72.59 119.7,71.07 R32.2 114.62,70.31 102.52,70.31 97.87,65.66 54.44,65.66 U1.36
TX1: length 23.6
  Top Layer w0.254: U1.3 23.97,16.36 Q14.1
TX4: length 86.8
  Top Layer w0.254: U1.39 30.81,42.54 v1(32.84,42.54)
  Bottom Layer w0.254: v1(32.84,42.54) 33.35,43.05 110.96,43.05 U6.4
TX5: length 80.1
  Top Layer w0.254: v1(32.08,41.78) 23.95,41.78 U1.42
  Bottom Layer w0.254: v1(32.08,41.78) 97.96,41.78 CN13.4
TX7: length 79.8
  Bottom Layer w0.254: U1.21 56.47,29.59 63.32,29.59 72.06,38.32 126.32,38.32 127.08,39.08 127.08,40.94 U5.4
$2N1400: length 44.9
  Top Layer w0.254: U2.4 40.91,57.49 v1(39.73,57.49) ; R1.2 9,69.75 CN14.4
  Bottom Layer w0.254: CN14.4 24.75,58.5 36.69,58.5 37.7,57.49 v1(39.73,57.49)
$2N1404: length 51.7
  Top Layer w0.254: v1(42.36,58.86) 42.36,58.35 42.11,58.1 41.09,58.1 U2.5 ; CN14.3 11,74.75 R2.2
  Bottom Layer w0.254: v1(42.36,58.86) 42.22,58.72 38.97,58.72 38.72,58.97 26.78,58.97 CN14.3
$2N1409: length 39.6
  Top Layer w0.254: CN15.4 17,69.72 R3.2 14.98,68.71 v1(14.22,67.95) ; v1(36.32,57.79) 36.57,57.54 38.86,57.54 40,58.67 U2.6
  Bottom Layer w0.254: v1(14.22,67.95) 24.38,57.79 v1(36.32,57.79)
$2N1414: length 56.8
  Top Layer w0.254: R4.2 18.7,75.05 CN15.3 ; U2.7 41.07,59.37 42.04,59.37 42.29,59.62 42.29,62.93 39.64,65.57 v1(39.35,65.57)
  Bottom Layer w0.254: CN15.3 18.27,78.02 41.38,78.02 42.91,76.5 42.91,69.13 v1(39.35,65.57)
$2N1419: length 28.1
  Top Layer w0.254: R5.2 25,69.75 CN16.4 ; U2.8 39.53,59.97 36.43,63.07 35.67,63.07 32.87,65.87 v1(32.87,66.38)
  Bottom Layer w0.254: CN16.4 v1(32.87,66.38)
$2N1424: length 32.7
  Top Layer w0.254: R6.2 27,74.75 CN16.3 ; U2.9 40.9,60.75 39.48,60.75 35.41,64.81 v1(34.91,64.81)
  Bottom Layer w0.254: CN16.3 34.91,66.84 v1(34.91,64.81)
$2N2020: length 28
  Top Layer w0.254: R15.1 43.39,74.36 CN18.3 ; v1(36.17,62.02) 35.07,62.02 U2.14
  Bottom Layer w0.254: v1(36.17,62.02) 36.17,67.86 42.27,73.96 42.27,75.48 CN18.3
$2N2036: length 25.5
  Top Layer w0.254: R14.1 49,69.56 CN19.4 ; U2.15 35,61.3 v1(36.55,61.3)
  Bottom Layer w0.254: v1(36.55,61.3) 36.55,61.55 49,74 CN19.4
$2N2050: length 33.3
  Top Layer w0.254: U2.16 36.94,60.62 37.32,61 v1(37.32,61.26) ; CN19.3 51.39,74.36 R13.1
  Bottom Layer w0.254: CN19.3 50.27,75.48 50.27,73.96 37.57,61.26 v1(37.32,61.26)
$2N2062: length 30.6
  Top Layer w0.254: v1(38.47,60.12) 35.12,60.12 U2.17 ; v1(46.35,67.99) 55.24,67.99 R12.1 57,69.75 CN20.4
  Bottom Layer w0.254: v1(46.35,67.99) v1(38.47,60.12)
$2N2072: length 38.1
  Top Layer w0.254: R11.1 59,74.75 CN20.3 ; v1(39.32,59.33) U2.18
  Bottom Layer w0.254: v1(39.32,59.33) 56.75,76.75 CN20.3
$2N2080: length 64.5
  Top Layer w0.254: U2.20 34.19,58.03 33.76,58.46 v1(33.76,64.05) ; v1(31.22,69.64) 31.22,76.5 32.74,78.02 63.73,78.02 CN21.3 67.26,74.49 R9.1
  Bottom Layer w0.254: v1(31.22,69.64) 31.22,68.62 32.74,67.1 33,67.1 33.5,66.59 33.5,64.3 v1(33.76,64.05)
$2N2083: length 42.6
  Top Layer w0.254: R10.1 65,69.63 CN21.4 ; U2.19 38.16,58.67 v1(38.58,58.25)
  Bottom Layer w0.254: v1(38.58,58.25) 49,58.25 CN21.4
$2N2247: length 20.5
  Top Layer w0.254: CN18.4 41,69.55 R16.1 ; U2.13 34.47,63.08 v1(34.47,63.25)
  Bottom Layer w0.254: CN18.4 35.74,68.99 35.74,64.52 v1(34.47,63.25)
$2N3196: length 18
  Top Layer w0.254: v1(34.29,66.47) 34.54,66.47 39.62,61.39 40.91,61.39 U2.10 ; CN17.4 33,69.75 R7.2 v1(32.76,67.99)
  Bottom Layer w0.254: v1(32.76,67.99) v1(34.29,66.47)
$2N3204: length 18.9
  Top Layer w0.254: v1(37.83,66.34) 37.83,64.3 40.11,62.02 40.93,62.02 U2.11 ; 35.03,68.88 35.29,68.88 v1(36.81,67.35) ; 35.03,68.88 35.03,74.72 CN17.3 ; 35.03,68.88 R8.2
  Bottom Layer w0.254: v1(36.81,67.35) v1(37.83,66.34)
$4N429: length 13.1
  Top Layer w0.254: 101.78,74.17 101.96,74.17 SONAR0.3 ; 101.78,74.17 Q1.3 ; 101.78,74.17 99.52,76.43 R19.2
$4N445: length 6.6
  Top Layer w0.254: Q2.2 108.63,74.94 R21.1 110.45,80.16 SONAR0.4
$4N1006: length 6.6
  Top Layer w0.254: SONAR1.4 110.45,65.77 R25.1 108.63,60.55 Q4.2
$4N1014: length 13.1
  Top Layer w0.254: 101.78,59.78 99.52,62.03 R23.2 ; 101.78,59.78 108.15,66.15 SONAR1.3 ; 101.78,59.78 Q3.3
$4N1413: length 13.1
  Top Layer w0.254: 117.64,59.78 115.38,62.03 R27.2 ; 117.64,59.78 117.82,59.78 SONAR2.3 ; 117.64,59.78 Q5.3
$4N1418: length 6.6
  Top Layer w0.254: Q6.2 124.49,60.55 R29.1 126.31,65.77 SONAR2.4
$4N1809: length 13.1
  Top Layer w0.254: Q7.3 117.64,74.17 ; 117.64,74.17 124.01,80.54 SONAR3.3 ; 117.64,74.17 115.38,76.43 R31.2
$4N1814: length 6.6
  Top Layer w0.254: SONAR3.4 126.31,80.16 R33.1 124.49,74.94 Q8.2
$5N1727: length 6.4
  Top Layer w0.254: CN3.1 19.8,18.8 19.76,18.83
$5N1738: length 6.8
  Top Layer w0.254: 28.02,18.83 27.42,18.23 v1(27.42,18.06)
  Bottom Layer w0.254: v1(27.42,18.06) 27.92,17.55 CN54.1
$5N1796: length 6.4
  Top Layer w0.254: 36.02,18.83 36.05,18.8 CN2.1
$5N1800: length 6.4
  Top Layer w0.254: 44.4,18.83 44.3,18.74 CN1.1
$5N2083: length 33.6
  Bottom Layer w0.254: H1.2 59.15,10.12 CN50.1 CN51.1 CN52.1 CN53.1
$5N2356: length 36.4
  Bottom Layer w0.254: H1.3 52.96,8.85 52.96,10.51 53.72,11.27 55.37,11.27 70.1,26 P2.2

## Text on the board
Top Silkscreen Layer: PWM / Custom / Power | + GND | 5V | GND | 5V / G / C | Teensy 4.1 Sensor Board v3 / © 2025 Wimble Robotics
